# EAGLE board cpu (EAGLE 4.15), part 1 of 3
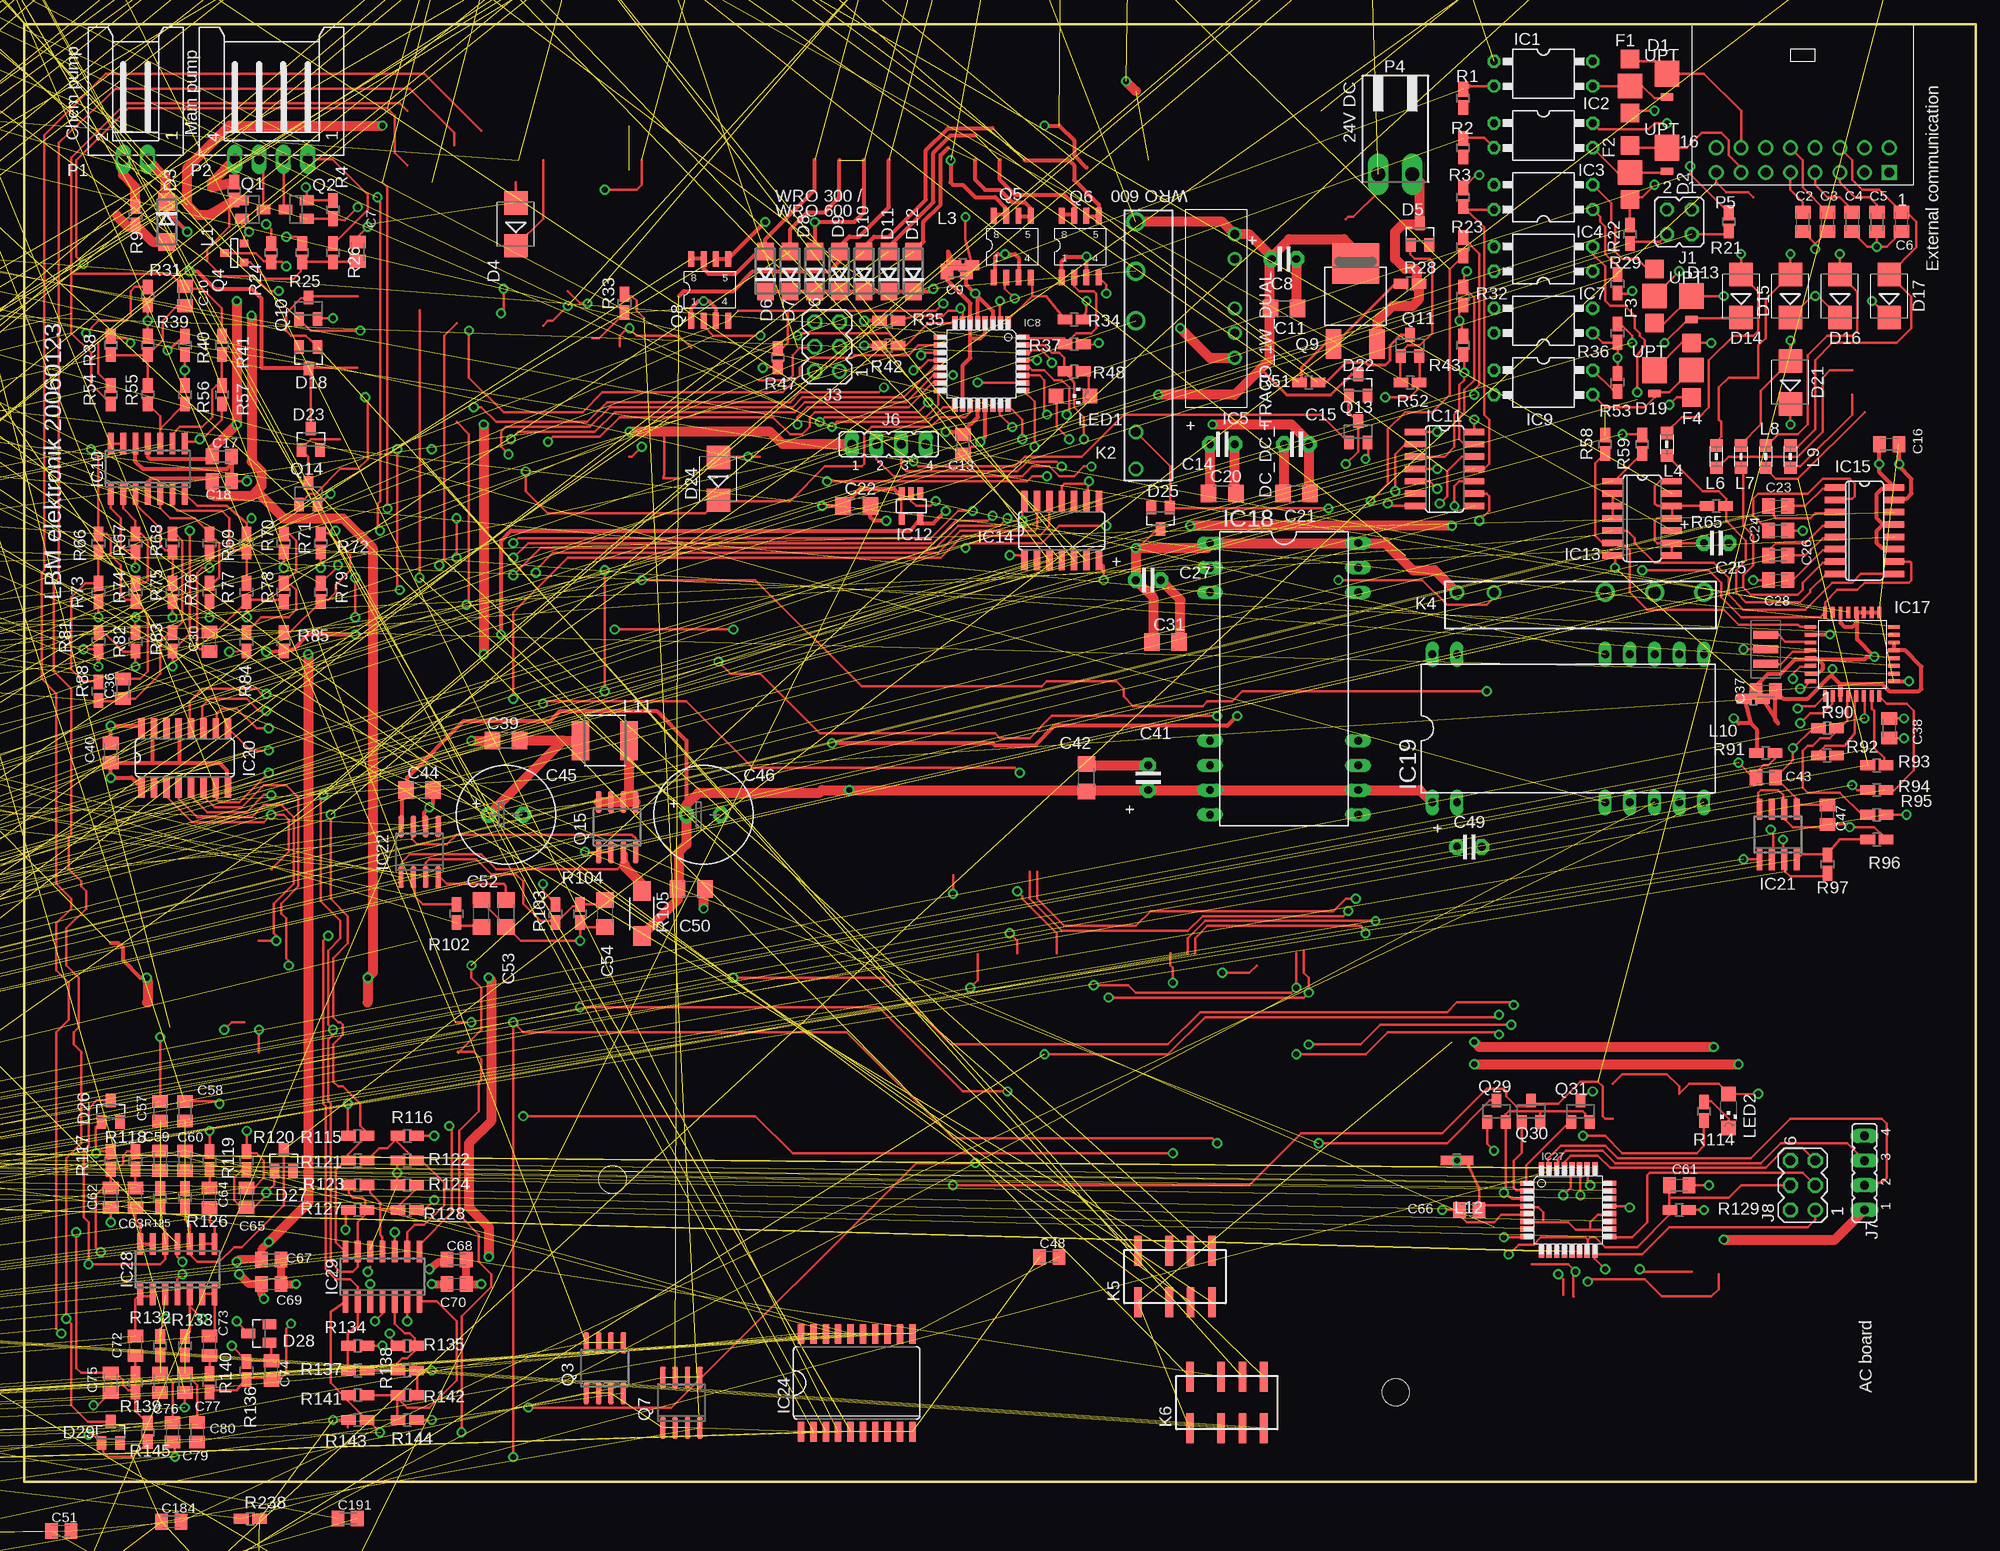
[diagram p20: board, top side]
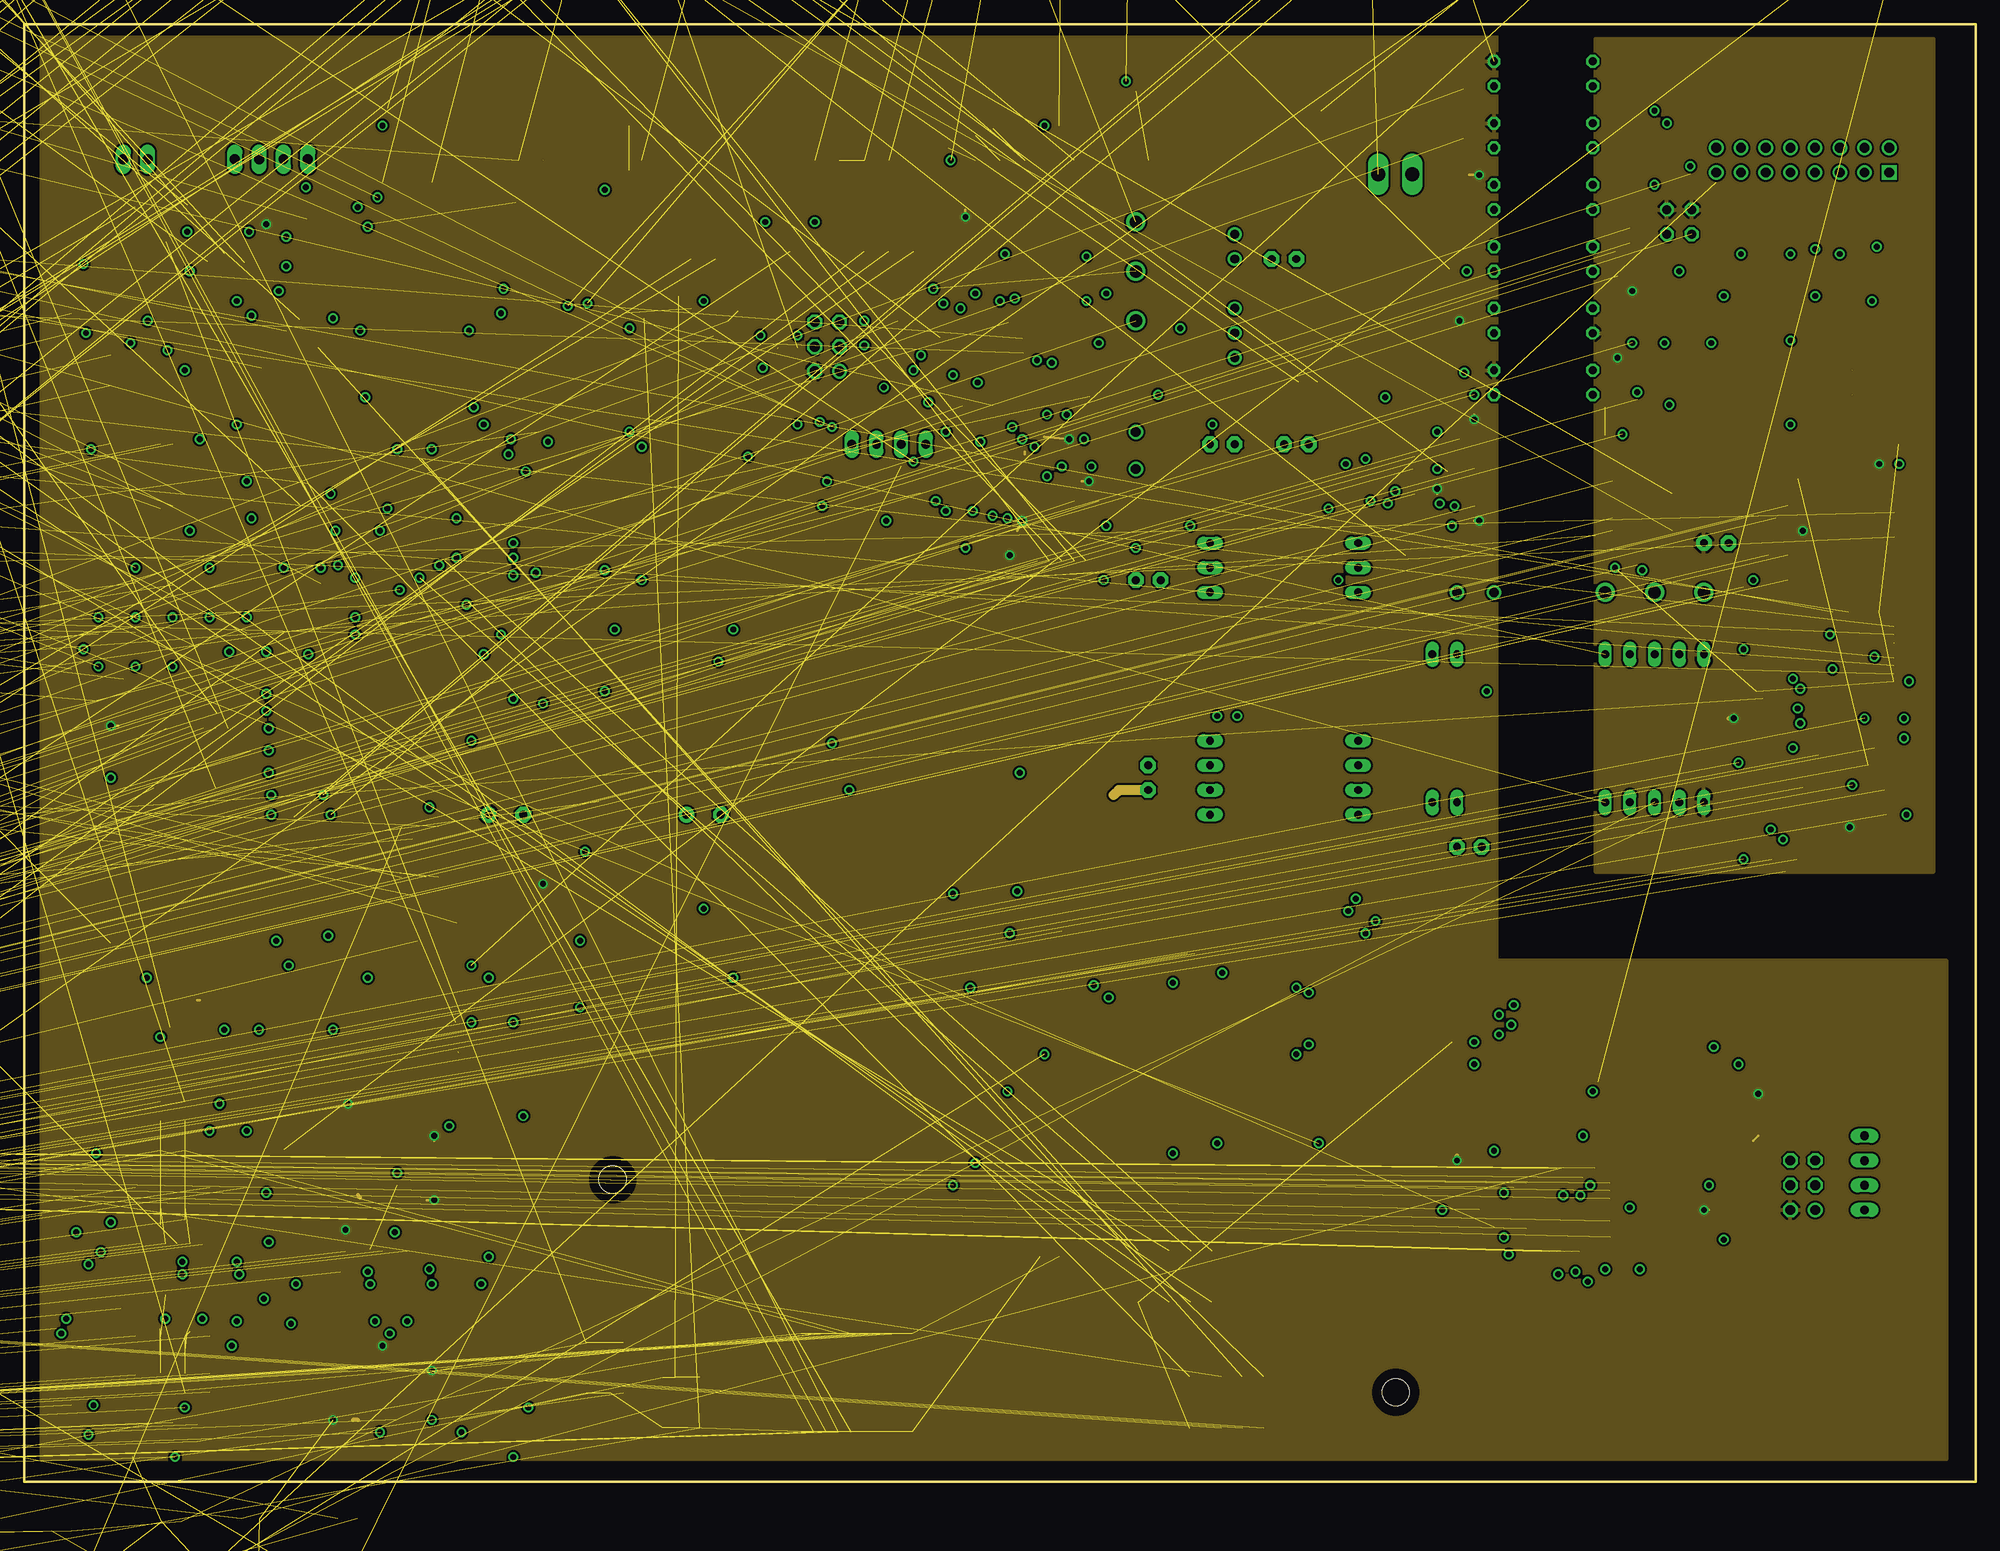
[diagram p21: board, inner layer Route2]
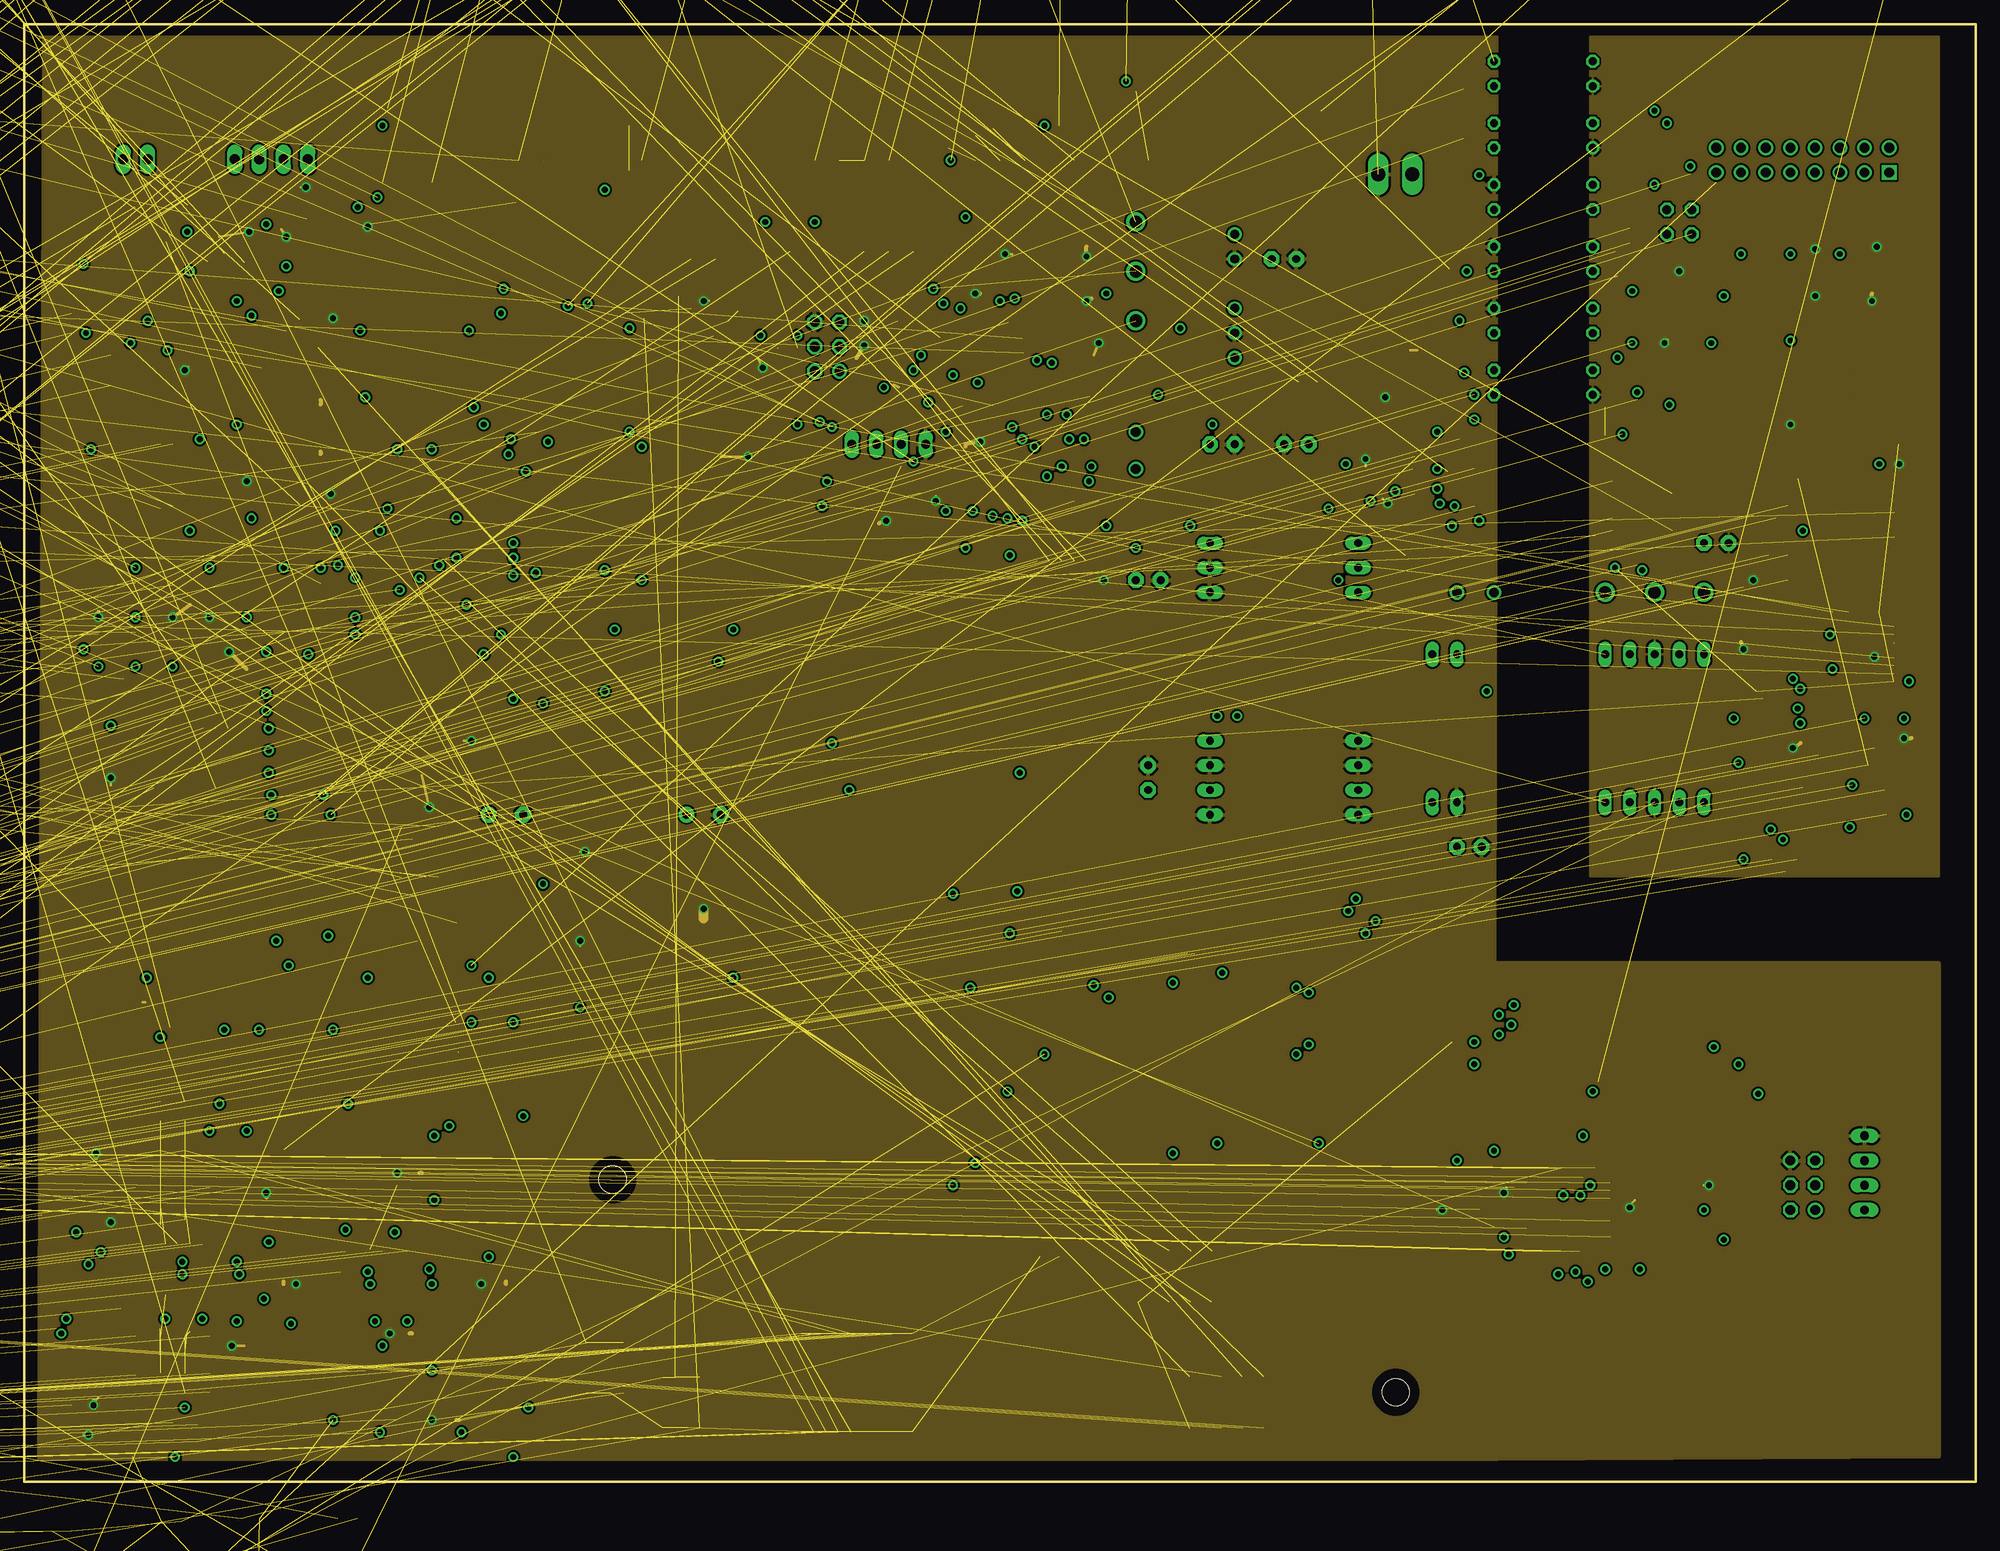
[diagram p22: board, inner layer Route15]
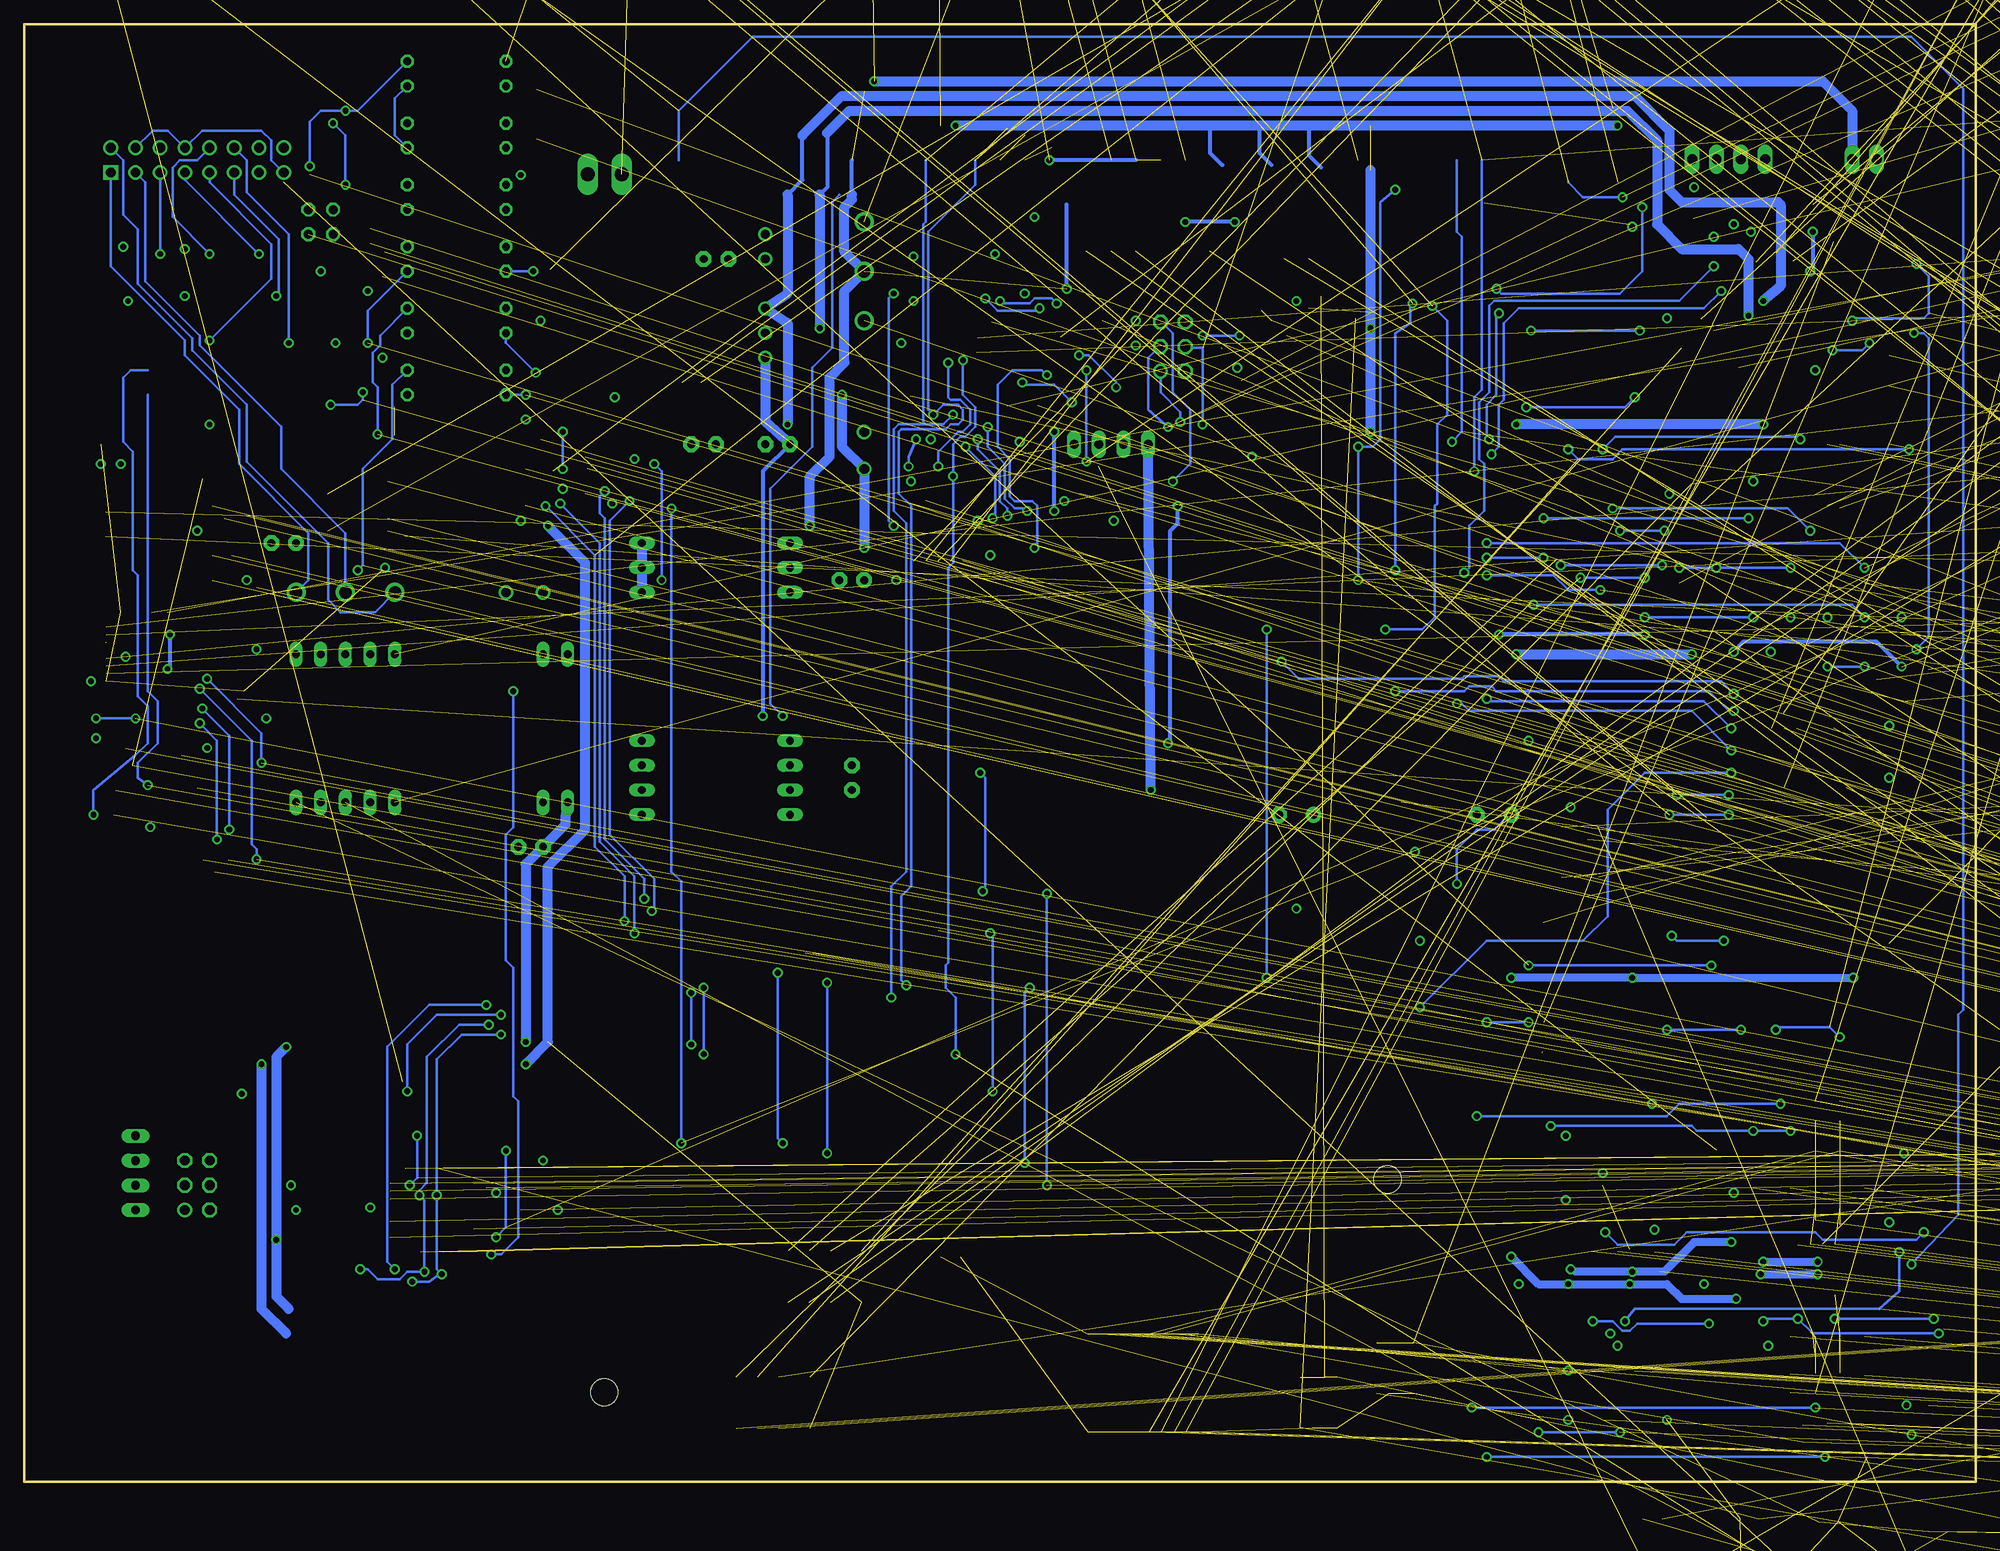
[diagram p23: board, bottom side, seen from below]

Size 200.66 x 149.86 mm. Coordinates in mm from the lower left corner, seen from the top.
Outline: 0,0 200.66,0 200.66,149.86 0,149.86 0,0
Copper layers (1*2+15*16): Top 0.035mm / dielectric 1.5mm / Route2 0.035mm / dielectric 0.15mm / Route15 0.035mm / dielectric 0.2mm / Bottom 0.035mm
Design rules "default": minimum track width 10mil, minimum drill 23mil, track to track 8mil, track to pad 8mil, pad to pad 8mil, via to via 8mil, smd to smd 8mil, copper to edge 40mil, drill to drill 8mil, minimum pad ring 10mil, minimum via ring 8mil, stop-mask expansion 4mil, vias tented up to drill 0mil, thermal gap 10mil
Holes 2.8 mm at 141.03,9.19 60.49,31.06
tKeepout: area 51.8,1.3 to 72.1,55.9; area 76.2,1.3 to 143.5,48.3; area 165.1,41.9 to 188,64.8

## Footprints (pad centres in the part's own frame; a part is rotated, then mirrored left to right if it is on the bottom)
C0805K = smd 1.3 x 1.6: 1 -1,0; 2 1,0
CAP2.5 = drill 0.813 pad 1.6 octagon: 1 -2.54,0; 2 0,0
C1206 = smd 1.6 x 1.8: 1 -1.4,0; 2 1.4,0
E3,5-10 = drill 0.813 pad 1.6 round: + -1.778,0 | drill 0.813 pad 1.6 octagon: - 1.778,0
UPT = smd 1.27 x 0.762: P$1 0,2.413 | smd 2.54 x 2.667: P$2 0,0
DO214AC = smd 1.8 x 1.7: A 2.05,0; C -2.05,0
SMB = smd 2.4 x 2.4: A 2.2,0; C -2.2,0
SOT23 = smd 1 x 1.4: 1 -0.95,-1.1; 2 0.95,-1.1; 3 0,1.1
T_FILTER = smd 2.54 x 2.54: P$1 0,0 | smd 1.905 x 1.905: P$2 -2.794,0; P$3 2.794,0
LVC2G74 = smd 0.3 x 0.7: 1 0.3,-2.5; 2 0.8,-2.5; 3 1.3,-2.5; 4 1.8,-2.5; 5 1.8,0.2; 6 1.3,0.2; 7 0.8,0.2; 8 0.3,0.2
CR2032V = drill 1.321 pad 3.15 octagon: + -2.54,-5.08; +@1 -2.54,5.08; - 2.286,0
DIL04B = drill 0.813 octagon: 1 -1.27,-5.08; 2 1.27,-5.08; 3 1.27,5.08; 4 -1.27,5.08
DC_DC_TRACO_1W_DUAL = drill 0.9 round: 1 -5.08,3.81; 2 -2.54,3.81; 3 2.54,3.81; 4 5.08,3.81; 5 7.62,3.81
SO14 = smd 0.66 x 2.032: 1 -3.81,-3.073; 2 -2.54,-3.073; 3 -1.27,-3.073; 4 0,-3.073; 5 1.27,-3.073; 6 2.54,-3.073; 7 3.81,-3.073; 8 3.81,3.073; 9 2.54,3.073; 10 1.27,3.073; 11 0,3.073; 12 -1.27,3.073; 13 -2.54,3.073; 14 -3.81,3.073
TQFP-32 = smd 1.27 x 0.559: 1 -4.293,2.743; 2 -4.293,1.956; 3 -4.293,1.168; 4 -4.293,0.381; 5 -4.293,-0.381; 6 -4.293,-1.168; 7 -4.293,-1.956; 8 -4.293,-2.743; 17 4.293,-2.743; 18 4.293,-1.956; 19 4.293,-1.168; 20 4.293,-0.381; 21 4.293,0.381; 22 4.293,1.168; 23 4.293,1.956; 24 4.293,2.743 | smd 0.559 x 1.27: 9 -2.743,-4.293; 10 -1.956,-4.293; 11 -1.168,-4.293; 12 -0.381,-4.293; 13 0.381,-4.293; 14 1.168,-4.293; 15 1.956,-4.293; 16 2.743,-4.293; 25 2.743,4.293; 26 1.956,4.293; 27 1.168,4.293; 28 0.381,4.293; 29 -0.381,4.293; 30 -1.168,4.293; 31 -1.956,4.293; 32 -2.743,4.293
SO14' = smd 0.6 x 2.2: 1 -3.81,-2.6; 2 -2.54,-2.6; 3 -1.27,-2.6; 4 0,-2.6; 5 1.27,-2.6; 6 2.54,-2.6; 7 3.81,-2.6; 8 3.81,2.6; 9 2.54,2.6; 10 1.27,2.6; 11 0,2.6; 12 -1.27,2.6; 13 -2.54,2.6; 14 -3.81,2.6
SOT23-5 = smd 0.6 x 1.2: 1 -0.95,-1.306; 2 0,-1.306; 3 0.95,-1.306; 4 0.95,1.306; 5 -0.95,1.306
SO16 = smd 0.66 x 2.032: 1 -4.445,-3.073; 2 -3.175,-3.073; 3 -1.905,-3.073; 4 -0.635,-3.073; 5 0.635,-3.073; 6 1.905,-3.073; 7 3.175,-3.073; 8 4.445,-3.073; 9 4.445,3.073; 10 3.175,3.073; 11 1.905,3.073; 12 0.635,3.073; 13 -0.635,3.073; 14 -1.905,3.073; 15 -3.175,3.073; 16 -4.445,3.073
LQFP32 = smd 0.4 x 1.2: 1 -2.8,-4.3; 2 -2,-4.3; 3 -1.2,-4.3; 4 -0.4,-4.3; 5 0.4,-4.3; 6 1.2,-4.3; 7 2,-4.3; 8 2.8,-4.3; 17 2.8,4.3; 18 2,4.3; 19 1.2,4.3; 20 0.4,4.3; 21 -0.4,4.3; 22 -1.2,4.3; 23 -2,4.3; 24 -2.8,4.3 | smd 1.2 x 0.4: 9 4.3,-2.8; 10 4.3,-2; 11 4.3,-1.2; 12 4.3,-0.4; 13 4.3,0.4; 14 4.3,1.2; 15 4.3,2; 16 4.3,2.8; 25 -4.3,2.8; 26 -4.3,2; 27 -4.3,1.2; 28 -4.3,0.4; 29 -4.3,-0.4; 30 -4.3,-1.2; 31 -4.3,-2; 32 -4.3,-2.8
DIL_TRACO_DCDC = drill 0.813 long: 1 -13.97,-7.62; 2 -11.43,-7.62; 3 -8.89,-7.62; 9 6.35,-7.62; 10 8.89,-7.62; 11 11.43,-7.62; 12 13.97,-7.62; 13 13.97,7.62; 14 11.43,7.62; 15 8.89,7.62; 16 6.35,7.62; 22 -8.89,7.62; 23 -11.43,7.62; 24 -13.97,7.62
DIL_NMSC_DCDC = drill 0.813 long: 1 -13.97,-7.62; 2 -11.43,-7.62; 8 3.81,-7.62; 9 6.35,-7.62; 10 8.89,-7.62; 11 11.43,-7.62; 12 13.97,-7.62; 13 13.97,7.62; 14 11.43,7.62; 15 8.89,7.62; 16 6.35,7.62; 17 3.81,7.62; 23 -11.43,7.62; 24 -13.97,7.62
SO-08 = smd 0.6 x 2.2: 1 -1.905,-2.6; 2 -0.635,-2.6; 3 0.635,-2.6; 4 1.905,-2.6; 5 1.905,2.6; 6 0.635,2.6; 7 -0.635,2.6; 8 -1.905,2.6
SO8 = smd 0.6 x 2.2: 1 -1.905,-2.6; 2 -0.635,-2.6; 3 0.635,-2.6; 4 1.905,-2.6; 5 1.905,2.6; 6 0.635,2.6; 7 -0.635,2.6; 8 -1.905,2.6
SO20W = smd 0.66 x 2.032: 1 -5.715,-5.029; 2 -4.445,-5.029; 3 -3.175,-5.029; 4 -1.905,-5.029; 5 -0.635,-5.029; 6 0.635,-5.029; 7 1.905,-5.029; 8 3.175,-5.029; 9 4.445,-5.029; 10 5.715,-5.029; 11 5.715,5.029; 12 4.445,5.029; 13 3.175,5.029; 14 1.905,5.029; 15 0.635,5.029; 16 -0.635,5.029; 17 -1.905,5.029; 18 -3.175,5.029; 19 -4.445,5.029; 20 -5.715,5.029
TSOP54 = smd 0.4 x 1.5: 1 -10.4,-5.08; 2 -9.6,-5.08; 3 -8.8,-5.08; 4 -8,-5.08; 5 -7.2,-5.08; 6 -6.4,-5.08; 7 -5.6,-5.08; 8 -4.8,-5.08; 9 -4,-5.08; 10 -3.2,-5.08; 11 -2.4,-5.08; 12 -1.6,-5.08; 13 -0.8,-5.08; 14 0,-5.08; 15 0.8,-5.08; 16 1.6,-5.08; 17 2.4,-5.08; 18 3.2,-5.08; 19 4,-5.08; 20 4.8,-5.08; 21 5.6,-5.08; 22 6.4,-5.08; 23 7.2,-5.08; 24 8,-5.08; 25 8.8,-5.08; 26 9.6,-5.08; 27 10.4,-5.08; 28 10.4,5.08; 29 9.6,5.08; 30 8.8,5.08; 31 8,5.08; 32 7.2,5.08; 33 6.4,5.08; 34 5.6,5.08; 35 4.8,5.08; 36 4,5.08; 37 3.2,5.08; 38 2.4,5.08; 39 1.6,5.08; 40 0.8,5.08; 41 0,5.08; 42 -0.8,5.08; 43 -1.6,5.08; 44 -2.4,5.08; 45 -3.2,5.08; 46 -4,5.08; 47 -4.8,5.08; 48 -5.6,5.08; 49 -6.4,5.08; 50 -7.2,5.08; 51 -8,5.08; 52 -8.8,5.08; 53 -9.6,5.08; 54 -10.4,5.08
ADM811 = smd 1.14 x 0.89: 1 -1.3,1.38 | smd 1.14 x 0.5: 2 -1.3,-0.53; 3 1.34,-0.53; 4 1.35,1.39
JP2Q = drill 0.914 octagon: 1 -1.27,-1.27; 2 -1.27,1.27; 3 1.27,-1.27; 4 1.27,1.27
MA03-2 = drill 1.016 round: 1 -2.54,-1.27 | drill 1.016 octagon: 2 -2.54,1.27; 3 0,-1.27; 4 0,1.27; 5 2.54,-1.27; 6 2.54,1.27
JP4 = drill 0.914 long: 1 -3.81,0; 2 -1.27,0; 3 1.27,0; 4 3.81,0
JTAG_HEADER = smd 2.413 x 0.457: 1 -0.127,-0.635; 2 3.556,-0.635; 3 -0.127,-1.905; 4 3.556,-1.905; 5 -0.127,-3.175; 6 3.556,-3.175; 7 -0.127,-4.445; 8 3.556,-4.445; 9 -0.127,-5.715; 10 3.556,-5.715; 11 -0.127,-6.985; 12 3.556,-6.985; 13 -0.127,-8.255; 14 3.556,-8.255; 15 -0.127,-9.525; 16 3.556,-9.525; 17 -0.127,-10.795; 18 3.556,-10.795; 19 -0.127,-12.065; 20 3.556,-12.065
SNR-V = drill 1.3 round: 11 7.62,1.27; 12 2.54,1.27; 14 12.7,1.27 | drill 1 round: A1 -12.7,1.27; A2 -8.89,1.27
GN-A = smd 0.8 x 3.1: 1 -3.835,-2.65; 2 -0.635,-2.65; 3 1.565,-2.65; 4 3.765,-2.65; 5 3.765,2.65; 6 1.565,2.65; 7 -0.635,2.65; 8 -3.835,2.65
L-0603 = smd 1.5 x 1: 1 -0.94,0; 2 0.94,0
IND_BLM = smd 1.27 x 1.27: P$1 -1.143,0; P$2 1.143,0
L5650M = smd 1.8 x 4: 1 -2.5,0; 2 2.5,0
CHIPLED_1206 = smd 1.5 x 1.5: A 0,-1.75; C 0,1.75
L02P = drill 1.016 long: 1 1.25,-6.25; 2 -1.25,-6.25
L04P = drill 1.016 long: 1 3.75,-6.25; 2 1.25,-6.25; 3 -1.25,-6.25; 4 -3.75,-6.25
MODU30 = drill 1 square: 1 22.86,-5.08 | drill 1 round: 2 20.32,-5.08; 3 17.78,-5.08; 4 15.24,-5.08; 5 12.7,-5.08; 6 10.16,-5.08; 7 7.62,-5.08; 8 5.08,-5.08; 9 2.54,-5.08; 10 0,-5.08; 11 -2.54,-5.08; 12 -5.08,-5.08; 13 -7.62,-5.08; 14 -10.16,-5.08; 15 -12.7,-5.08; 16 22.86,-2.54; 17 20.32,-2.54; 18 17.78,-2.54; 19 15.24,-2.54; 20 12.7,-2.54; 21 10.16,-2.54; 22 7.62,-2.54; 23 5.08,-2.54; 24 2.54,-2.54; 25 0,-2.54; 26 -2.54,-2.54; 27 -5.08,-2.54; 28 -7.62,-2.54; 29 -10.16,-2.54; 30 -12.7,-2.54
90-2 = drill 1.422 long: 1 -1.75,5.25; 2 1.75,5.25
MODU16 = drill 1 square: P$1 13.97,-5.08 | drill 1 round: P$2 11.43,-5.08; P$3 8.89,-5.08; P$4 6.35,-5.08; P$5 3.81,-5.08; P$6 1.27,-5.08; P$7 -1.27,-5.08; P$8 -3.81,-5.08; P$13 13.97,-2.54; P$14 11.43,-2.54; P$15 8.89,-2.54; P$16 6.35,-2.54; P$17 3.81,-2.54; P$18 1.27,-2.54; P$19 -1.27,-2.54; P$20 -3.81,-2.54
MODU44 = drill 1 square: P$1 0,0 | drill 1 round: P$2 -2.54,0; P$3 -5.08,0; P$4 -7.62,0; P$5 -10.16,0; P$6 -12.7,0; P$7 -15.24,0; P$8 -17.78,0; P$9 -20.32,0; P$10 -22.86,0; P$11 -25.4,0; P$12 -27.94,0; P$13 -30.48,0; P$14 -33.02,0; P$15 -35.56,0; P$16 -38.1,0; P$17 -40.64,0; P$18 -43.18,0; P$19 -45.72,0; P$20 -48.26,0; P$21 -50.8,0; P$22 -53.34,0; P$23 0,2.54; P$24 -2.54,2.54; P$25 -5.08,2.54; P$26 -7.62,2.54; P$27 -10.16,2.54; P$28 -12.7,2.54; P$29 -15.24,2.54; P$30 -17.78,2.54; P$31 -20.32,2.54; P$32 -22.86,2.54; P$33 -25.4,2.54; P$34 -27.94,2.54; P$35 -30.48,2.54; P$36 -33.02,2.54; P$37 -35.56,2.54; P$38 -38.1,2.54; P$39 -40.64,2.54; P$40 -43.18,2.54; P$41 -45.72,2.54; P$42 -48.26,2.54; P$43 -50.8,2.54; P$44 -53.34,2.54
RJ_45 = drill 0.889 round: 1 0.762,-1.524; 2 2.032,1.016; 3 3.302,-1.524; 4 4.572,1.016; 5 5.842,-1.524; 6 7.112,1.016; 7 8.382,-1.524; 8 9.652,1.016; 9 -0.508,1.016; 10 10.922,-1.524 | drill 1.016 round: 11 -1.778,-11.938; 12 0.762,-11.938; 13 9.652,-11.938; 14 12.192,-11.938 | drill 1.549 round: 15 -1.524,-4.318; 16 11.938,-4.318 | hole 3.251: 10.922,-7.874; -0.508,-7.874
SOT-23 = smd 0.787 x 0.889: 1 0.025,-1.016; 2 -0.94,1.016; 3 0.991,1.016
SO8-2 = smd 0.61 x 1.626: 1 -2.54,-2.54; 2 -1.27,-2.54; 3 0,-2.54; 4 1.27,-2.54; 5 1.27,3.81; 6 0,3.81; 7 -1.27,3.81; 8 -2.54,3.81
DPAK = smd 1.6 x 2.997: 1 -2.261,-4.928; 3 2.21,-4.928 | smd 4.826 x 4.191: 4 0,3.353
SOT54A = drill 0.813 octagon: B 0,1.905; C -1.27,0; E 1.27,0
R0805W = smd 1.5 x 1: 1 -0.94,0; 2 0.94,0
R2010W = smd 2 x 1.8: 1 -2.311,0; 2 2.311,0
NS9360 = smd 0.762 x 0.762: A1 0,0; A2 0,-1.27; A3 0,-2.54; A4 0,-3.81; A5 0,-5.08; A6 0,-6.35; A7 0,-7.62; A8 0,-8.89; A9 0,-10.16; A10 0,-11.43; A11 0,-12.7; A12 0,-13.97; A13 0,-15.24; A14 0,-16.51; A15 0,-17.78; A16 0,-19.05; A17 0,-20.32; A18 0,-21.59; A19 0,-22.86; A20 0,-24.13; B1 -1.27,0; B2 -1.27,-1.27; B3 -1.27,-2.54; B4 -1.27,-3.81; B5 -1.27,-5.08; B6 -1.27,-6.35; B7 -1.27,-7.62; B8 -1.27,-8.89; B9 -1.27,-10.16; B10 -1.27,-11.43; B11 -1.27,-12.7; B12 -1.27,-13.97; B13 -1.27,-15.24; B14 -1.27,-16.51; B15 -1.27,-17.78; B16 -1.27,-19.05; B17 -1.27,-20.32; B18 -1.27,-21.59; B19 -1.27,-22.86; B20 -1.27,-24.13; C1 -2.54,0; C2 -2.54,-1.27; C3 -2.54,-2.54; C4 -2.54,-3.81; C5 -2.54,-5.08; C6 -2.54,-6.35; C7 -2.54,-7.62; C8 -2.54,-8.89; C9 -2.54,-10.16; C10 -2.54,-11.43; C11 -2.54,-12.7; C12 -2.54,-13.97; C13 -2.54,-15.24; C14 -2.54,-16.51; C15 -2.54,-17.78; C16 -2.54,-19.05; C17 -2.54,-20.32; C18 -2.54,-21.59; C19 -2.54,-22.86; C20 -2.54,-24.13; D1 -3.81,0; D2 -3.81,-1.27; D3 -3.81,-2.54; D4 -3.81,-3.81; D5 -3.81,-5.08; D6 -3.81,-6.35; D7 -3.81,-7.62; D8 -3.81,-8.89; D9 -3.81,-10.16; D10 -3.81,-11.43; D11 -3.81,-12.7; D12 -3.81,-13.97; D13 -3.81,-15.24; D14 -3.81,-16.51; D15 -3.81,-17.78; D16 -3.81,-19.05; D17 -3.81,-20.32; D18 -3.81,-21.59; D19 -3.81,-22.86; D20 -3.81,-24.13; E1 -5.08,0; E2 -5.08,-1.27; E3 -5.08,-2.54; E4 -5.08,-3.81; E17 -5.08,-20.32; E18 -5.08,-21.59; E19 -5.08,-22.86; E20 -5.08,-24.13; F1 -6.35,0; F2 -6.35,-1.27; F3 -6.35,-2.54; F4 -6.35,-3.81; F17 -6.35,-20.32; F18 -6.35,-21.59; F19 -6.35,-22.86; F20 -6.35,-24.13; G1 -7.62,0; G2 -7.62,-1.27; G3 -7.62,-2.54; G4 -7.62,-3.81; G17 -7.62,-20.32; G18 -7.62,-21.59; G19 -7.62,-22.86; G20 -7.62,-24.13; H1 -8.89,0; H2 -8.89,-1.27; H3 -8.89,-2.54; H4 -8.89,-3.81; H17 -8.89,-20.32; H18 -8.89,-21.59; H19 -8.89,-22.86; H20 -8.89,-24.13; J1 -10.16,0; J2 -10.16,-1.27; J3 -10.16,-2.54; J4 -10.16,-3.81; J9 -10.16,-10.16; J10 -10.16,-11.43; J11 -10.16,-12.7; J12 -10.16,-13.97; J17 -10.16,-20.32; J18 -10.16,-21.59; J19 -10.16,-22.86; J20 -10.16,-24.13; K1 -11.43,0; K2 -11.43,-1.27; K3 -11.43,-2.54; K4 -11.43,-3.81; K9 -11.43,-10.16; K10 -11.43,-11.43; K11 -11.43,-12.7; K12 -11.43,-13.97; K17 -11.43,-20.32; K18 -11.43,-21.59; K19 -11.43,-22.86; K20 -11.43,-24.13; L1 -12.7,0; L2 -12.7,-1.27; L3 -12.7,-2.54; L4 -12.7,-3.81; L9 -12.7,-10.16; L10 -12.7,-11.43; L11 -12.7,-12.7; L12 -12.7,-13.97; L17 -12.7,-20.32; L18 -12.7,-21.59; L19 -12.7,-22.86; L20 -12.7,-24.13; M1 -13.97,0; M2 -13.97,-1.27; M3 -13.97,-2.54; M4 -13.97,-3.81; M9 -13.97,-10.16; M10 -13.97,-11.43; M11 -13.97,-12.7; M12 -13.97,-13.97; M17 -13.97,-20.32; M18 -13.97,-21.59; M19 -13.97,-22.86; M20 -13.97,-24.13; N1 -15.24,0; N2 -15.24,-1.27; N3 -15.24,-2.54; N4 -15.24,-3.81; N17 -15.24,-20.32; N18 -15.24,-21.59; N19 -15.24,-22.86; N20 -15.24,-24.13; P1 -16.51,0; P2 -16.51,-1.27; P3 -16.51,-2.54; P4 -16.51,-3.81; P17 -16.51,-20.32; P18 -16.51,-21.59; P19 -16.51,-22.86; P20 -16.51,-24.13; R1 -17.78,0; R2 -17.78,-1.27; R3 -17.78,-2.54; R4 -17.78,-3.81; R17 -17.78,-20.32; R18 -17.78,-21.59; R19 -17.78,-22.86; R20 -17.78,-24.13; T1 -19.05,0; T2 -19.05,-1.27; T3 -19.05,-2.54; T4 -19.05,-3.81; T17 -19.05,-20.32; T18 -19.05,-21.59; T19 -19.05,-22.86; T20 -19.05,-24.13; U1 -20.32,0; U2 -20.32,-1.27; U3 -20.32,-2.54; U4 -20.32,-3.81; U5 -20.32,-5.08; U6 -20.32,-6.35; U7 -20.32,-7.62; U8 -20.32,-8.89; U9 -20.32,-10.16; U10 -20.32,-11.43; U11 -20.32,-12.7; U12 -20.32,-13.97; U13 -20.32,-15.24; U14 -20.32,-16.51; U15 -20.32,-17.78; U16 -20.32,-19.05; U17 -20.32,-20.32; U18 -20.32,-21.59; U19 -20.32,-22.86; U20 -20.32,-24.13; V1 -21.59,0; V2 -21.59,-1.27; V3 -21.59,-2.54; V4 -21.59,-3.81; V5 -21.59,-5.08; V6 -21.59,-6.35; V7 -21.59,-7.62; V8 -21.59,-8.89; V9 -21.59,-10.16; V10 -21.59,-11.43; V11 -21.59,-12.7; V12 -21.59,-13.97; V13 -21.59,-15.24; V14 -21.59,-16.51; V15 -21.59,-17.78; V16 -21.59,-19.05; V17 -21.59,-20.32; V18 -21.59,-21.59; V19 -21.59,-22.86; V20 -21.59,-24.13; W1 -22.86,0; W2 -22.86,-1.27; W3 -22.86,-2.54; W4 -22.86,-3.81; W5 -22.86,-5.08; W6 -22.86,-6.35; W7 -22.86,-7.62; W8 -22.86,-8.89; W9 -22.86,-10.16; W10 -22.86,-11.43; W11 -22.86,-12.7; W12 -22.86,-13.97; W13 -22.86,-15.24; W14 -22.86,-16.51; W15 -22.86,-17.78; W16 -22.86,-19.05; W17 -22.86,-20.32; W18 -22.86,-21.59; W19 -22.86,-22.86; W20 -22.86,-24.13; Y1 -24.13,0; Y2 -24.13,-1.27; Y3 -24.13,-2.54; Y4 -24.13,-3.81; Y5 -24.13,-5.08; Y6 -24.13,-6.35; Y7 -24.13,-7.62; Y8 -24.13,-8.89; Y9 -24.13,-10.16; Y10 -24.13,-11.43; Y11 -24.13,-12.7; Y12 -24.13,-13.97; Y13 -24.13,-15.24; Y14 -24.13,-16.51; Y15 -24.13,-17.78; Y16 -24.13,-19.05; Y17 -24.13,-20.32; Y18 -24.13,-21.59; Y19 -24.13,-22.86; Y20 -24.13,-24.13
TESTPAD = drill 1.321 pad 2.159 octagon: 1 0,0
TSOP48 = smd 0.3 x 1.6: 1 -5.75,-10.87; 2 -5.25,-10.87; 3 -4.75,-10.87; 4 -4.25,-10.87; 5 -3.75,-10.87; 6 -3.25,-10.87; 7 -2.75,-10.87; 8 -2.25,-10.87; 9 -1.75,-10.87; 10 -1.25,-10.87; 11 -0.75,-10.87; 12 -0.25,-10.87; 13 0.25,-10.87; 14 0.75,-10.87; 15 1.25,-10.87; 16 1.75,-10.87; 17 2.25,-10.87; 18 2.75,-10.87; 19 3.25,-10.87; 20 3.75,-10.87; 21 4.25,-10.87; 22 4.75,-10.87; 23 5.25,-10.87; 24 5.75,-10.87; 25 5.75,8.33; 26 5.25,8.33; 27 4.75,8.33; 28 4.25,8.33; 29 3.75,8.33; 30 3.25,8.33; 31 2.75,8.33; 32 2.25,8.33; 33 1.75,8.33; 34 1.25,8.33; 35 0.75,8.33; 36 0.25,8.33; 37 -0.25,8.33; 38 -0.75,8.33; 39 -1.25,8.33; 40 -1.75,8.33; 41 -2.25,8.33; 42 -2.75,8.33; 43 -3.25,8.33; 44 -3.75,8.33; 45 -4.25,8.33; 46 -4.75,8.33; 47 -5.25,8.33; 48 -5.75,8.33
MSOP8 = smd 0.4 x 1.1: 1 -0.975,-2.25; 2 -0.325,-2.25; 3 0.325,-2.25; 4 0.975,-2.25; 5 0.975,2.25; 6 0.325,2.25; 7 -0.325,2.25; 8 -0.975,2.25
ISC1893BF = smd 1.54 x 0.34: 1 -0.83,-0.68; 2 -0.83,-1.32; 3 -0.83,-1.97; 4 -0.83,-2.61; 5 -0.83,-3.24; 6 -0.83,-3.88; 7 -0.83,-4.53; 8 -0.83,-5.17; 9 -0.83,-5.83; 10 -0.83,-6.47; 11 -0.83,-7.12; 12 -0.83,-7.76; 13 -0.83,-8.39; 14 -0.83,-9.03; 15 -0.83,-9.68; 16 -0.83,-10.32; 17 -0.83,-10.96; 18 -0.83,-11.6; 19 -0.83,-12.25; 20 -0.83,-12.89; 21 -0.83,-13.52; 22 -0.83,-14.16; 23 -0.83,-14.81; 24 -0.83,-15.45; 25 8.46,-15.46; 26 8.46,-14.82; 27 8.46,-14.17; 28 8.46,-13.53; 29 8.46,-12.9; 30 8.46,-12.26; 31 8.46,-11.61; 32 8.46,-10.97; 33 8.46,-10.33; 34 8.46,-9.69; 35 8.46,-9.04; 36 8.46,-8.4; 37 8.46,-7.77; 38 8.46,-7.13; 39 8.46,-6.48; 40 8.46,-5.84; 41 8.46,-5.18; 42 8.46,-4.54; 43 8.46,-3.89; 44 8.46,-3.25; 45 8.46,-2.62; 46 8.46,-1.98; 47 8.46,-1.33; 48 8.46,-0.69
MURATA_RESONATOR = smd 0.8 x 2.6: 1 -1.5,0; 2 0,0; 3 1.5,0
MM20SS = smd 1.27 x 1.88: 1 -2.794,-1.524; 2 2.794,-1.524; 3 2.794,1.524; 4 -2.794,1.524
HC49_4H_SMX = smd 5.5 x 2: 1 2.5,-1; 2 12,-1
EMI_FILTER_1206 = smd 0.4 x 1.1: 1 0,-0.82; 2 3.4,-0.86 | smd 0.4 x 0.3: 3 0.46,-1.68; 4 1.28,-1.68; 5 2.06,-1.68; 6 2.88,-1.68; 7 0.484,-0.02; 8 1.26,-0.02; 9 2.076,-0.02; 10 2.86,-0.02; P$3 1.26,-0.02; P$21 1.28,-1.68

## Placement (x,y rotation side)
C1  100nF  [C0805K]  477.59,440.28 0 top  (outside the outline)
C2  100n  [C0805K]  182.88,129.54 90 top
C3  100n  [C0805K]  185.42,129.54 90 top
C4  100n  [C0805K]  187.96,129.54 90 top
C5  100n  [C0805K]  190.5,129.54 90 top
C6  100n  [C0805K]  193.04,129.54 90 top
C7  100n  [C0805K]  34.29,126.49 270 top
C8  47u/25V  [CAP2.5]  130.81,125.73 0 top
C9  100n  [C0805K]  95.89,124.46 180 top
C10  100n  [C0805K]  16.51,121.92 90 top
C11  100n  [C1206]  129.54,120.65 0 top
C12  1uF_NM  [C0805K]  -24.07,422.39 0 top  (outside the outline)
C13  100n  [C0805K]  96.52,106.68 90 top
C14  47u/25V  [CAP2.5]  124.46,106.68 0 top
C15  47u/25V  [CAP2.5]  132.08,106.68 0 top
C16  100n  [C0805K]  191.77,106.68 180 top
C17  100n  [C0805K]  20.32,105.41 0 top
C18  100n  [C0805K]  20.32,102.87 180 top
C19  1u  [C0805K]  -24.07,422.39 0 top  (outside the outline)
C20  100n  [C1206]  123.19,101.6 0 top
C21  100n  [C1206]  130.81,101.6 0 top
C22  100n  [C1206]  85.6,100.33 0 top
C23  100n  [C0805K]  180.34,100.33 0 top
C24  100n  [C0805K]  180.34,97.79 0 top
C25  47u/25V  [CAP2.5]  175.26,96.52 0 top
C26  100n  [C0805K]  180.34,95.25 180 top
C27  47u/50V  [CAP2.5]  116.84,92.71 0 top
C28  100n  [C0805K]  180.34,92.71 180 top
C29  100n  [C0805K]  -156.87,423.32 0 top  (outside the outline)
C30  100n  [C0805K]  19.05,86.36 90 top
C31  100n  [C1206]  117.35,86.36 0 top
C32  100n  [C0805K]  -147.87,423.32 0 top  (outside the outline)
C33  100n  [C0805K]  -167.55,423.32 0 top  (outside the outline)
C34  100n  [C0805K]  -158.54,423.32 0 top  (outside the outline)
C35  100n  [C0805K]  -149.53,423.32 0 top  (outside the outline)
C36  100n  [C0805K]  10.16,81.53 90 top
C37  100n  [C0805K]  179.07,81.28 0 top
C38  100n  [C0805K]  191.77,77.47 270 top
C39  100n  [C1206]  49.53,76.2 180 top
C40  100n  [C0805K]  8.89,74.93 90 top
C41  47u/25V  [CAP2.5]  115.57,73.66 90 top
C42  100n  [C1206]  109.22,72.39 90 top
C43  100n  [C0805K]  179.07,72.39 0 top
C44  NM  [C1206]  40.64,71.12 0 top
C45  330uF  [E3,5-10]  49.53,68.58 0 top
C46  180uF  [E3,5-10]  69.85,68.58 0 top
C47  100n  [C0805K]  185.42,68.58 270 top
C48  100n  [C0805K]  105.41,23.11 0 top
C49  47u/25V  [CAP2.5]  149.86,65.28 0 top
C50  470p  [C1206]  68.58,60.96 0 top
C51  100n  [C0805K]  3.81,-5.08 0 top  (outside the outline)
C52  220p  [C1206]  46.99,58.42 90 top
C53  470p  [C1206]  49.53,58.42 270 top
C54  100p  [C1206]  59.69,58.42 270 top
C55  100n  [C0805K]  3.81,-12.7 0 top  (outside the outline)
C56  10pF  [C0805K]  -76.29,445.67 0 top  (outside the outline)
C57  1uF_NM  [C0805K]  13.97,38.1 90 top
C58  1uF_NM  [C0805K]  16.51,38.1 90 top
C59  100n  [C0805K]  13.97,33.02 90 top
C60  470n  [C0805K]  16.51,33.02 90 top
C61  1uF_NM  [C0805K]  170.18,30.48 180 top
C62  100p  [C0805K]  8.89,29.21 90 top
C63  1u0  [C0805K]  11.43,29.21 90 top
C64  1u0  [C0805K]  19.05,29.21 90 top
C65  100p  [C0805K]  22.86,29.21 90 top
C66  100n  [C0805K]  148.59,27.94 0 top
C67  100n  [C0805K]  25.4,22.86 0 top
C68  100n  [C0805K]  44.45,22.86 0 top
C69  100n  [C0805K]  25.4,20.32 180 top
C70  100n  [C0805K]  44.45,20.32 180 top
C71  100n  [C0805K]  -152.33,411.82 0 top  (outside the outline)
C72  1u0  [C0805K]  11.43,13.97 270 top
C73  1u0  [C0805K]  19.05,13.97 270 top
C74  100p  [C0805K]  25.4,11.43 270 top
C75  100p  [C0805K]  8.89,10.16 90 top
C76  100n  [C0805K]  13.97,10.16 270 top
C77  1uF_NM  [C0805K]  16.51,10.16 270 top
C78  100n  [C0805K]  -167.55,423.32 0 top  (outside the outline)
C79  1uF_NM  [C0805K]  15.24,5.08 270 top
C80  470n  [C0805K]  17.78,5.08 270 top
C81  10pF  [C0805K]  -67.28,445.68 0 top  (outside the outline)
C82  100nF  [C0805K]  -58.27,445.69 0 top  (outside the outline)
C83  100nF  [C0805K]  -49.26,445.67 0 top  (outside the outline)
C84  100n  [C0805K]  -40.24,445.67 0 top  (outside the outline)
C85  10pF  [C0805K]  -31.23,445.68 0 top  (outside the outline)
C86  100n  [C0805K]  36.37,435.15 0 top  (outside the outline)
C87  10n  [C0805K]  45.38,435.16 0 top  (outside the outline)
C88  100n  [C0805K]  54.39,435.17 0 top  (outside the outline)
C89  10n  [C0805K]  63.41,435.15 0 top  (outside the outline)
C90  10n  [C0805K]  72.42,435.16 0 top  (outside the outline)
C91  10n  [C0805K]  81.43,435.17 0 top  (outside the outline)
C92  1u  [C0805K]  90.44,435.15 0 top  (outside the outline)
C93  1u  [C0805K]  99.45,435.16 0 top  (outside the outline)
C94  1u  [C0805K]  108.46,435.17 0 top  (outside the outline)
C95  1u  [C0805K]  117.47,435.15 0 top  (outside the outline)
C96  10u  [C0805K]  36.37,441.89 0 top  (outside the outline)
C97  10u  [C0805K]  45.38,441.9 0 top  (outside the outline)
C98  10n  [C0805K]  54.39,441.89 0 top  (outside the outline)
C99  1u  [C0805K]  63.41,441.9 0 top  (outside the outline)
C100  10n  [C0805K]  72.42,441.9 0 top  (outside the outline)
C101  100n  [C0805K]  81.43,441.89 0 top  (outside the outline)
C102  10n  [C0805K]  90.44,441.9 0 top  (outside the outline)
C103  100n  [C0805K]  99.45,441.9 0 top  (outside the outline)
C104  10n  [C0805K]  108.46,441.89 0 top  (outside the outline)
C105  10n  [C0805K]  117.47,441.9 0 top  (outside the outline)
C106  10n  [C0805K]  36.37,448.64 0 top  (outside the outline)
C107  100n  [C0805K]  45.38,448.62 0 top  (outside the outline)
C108  10n  [C0805K]  54.39,448.63 0 top  (outside the outline)
C109  10n  [C0805K]  63.41,448.64 0 top  (outside the outline)
C110  1u  [C0805K]  72.42,448.62 0 top  (outside the outline)
C111  10u  [C0805K]  81.43,448.63 0 top  (outside the outline)
C112  10n  [C0805K]  90.44,448.61 0 top  (outside the outline)
C113  10u  [C0805K]  99.45,448.62 0 top  (outside the outline)
C114  100u  [CAP2.5]  115.64,405.13 0 top  (outside the outline)
C115  100n  [C0805K]  108.46,448.63 0 top  (outside the outline)
C116  10u  [C0805K]  117.47,448.62 0 top  (outside the outline)
C117  100n  [C0805K]  36.37,455.36 0 top  (outside the outline)
C118  100n  [C0805K]  45.38,455.37 0 top  (outside the outline)
C119  10n  [C0805K]  54.39,455.35 0 top  (outside the outline)
C120  10n  [C0805K]  94.43,460.66 0 top  (outside the outline)
C121  100n  [C0805K]  87.88,460.94 0 top  (outside the outline)
C122  10n  [C0805K]  96.89,460.94 0 top  (outside the outline)
C123  100n  [C0805K]  105.9,460.94 0 top  (outside the outline)
C124  10n  [C0805K]  114.91,460.94 0 top  (outside the outline)
C125  10n  [C0805K]  36.37,460.94 0 top  (outside the outline)
C126  100n  [C0805K]  45.38,460.94 0 top  (outside the outline)
C127  10n  [C0805K]  54.39,460.94 0 top  (outside the outline)
C128  10n  [C0805K]  180.63,414.3 0 top  (outside the outline)
C129  100n  [C0805K]  189.64,414.31 0 top  (outside the outline)
C130  10n  [C0805K]  198.65,414.32 0 top  (outside the outline)
C131  100n  [C0805K]  207.66,414.3 0 top  (outside the outline)
C132  10n  [C0805K]  216.67,414.31 0 top  (outside the outline)
C133  100n  [C0805K]  225.68,414.32 0 top  (outside the outline)
C134  10n  [C0805K]  234.7,414.3 0 top  (outside the outline)
C135  100n  [C0805K]  243.71,414.31 0 top  (outside the outline)
C136  10n  [C0805K]  252.72,414.32 0 top  (outside the outline)
C137  100n  [C0805K]  261.73,414.3 0 top  (outside the outline)
C138  22p  [C0805K]  270.74,414.32 0 top  (outside the outline)
C139  22p  [C0805K]  180.63,407.58 0 top  (outside the outline)
C140  100n  [C0805K]  189.64,407.57 0 top  (outside the outline)
C141  10n  [C0805K]  198.65,407.58 0 top  (outside the outline)
C142  100n  [C0805K]  22.85,-12.41 0 top  (outside the outline)
C143  100n  [C0805K]  365.03,428.48 0 top  (outside the outline)
C144  100n  [C0805K]  374.04,428.49 0 top  (outside the outline)
C145  100n  [C0805K]  383.05,428.49 0 top  (outside the outline)
C146  22p  [C0805K]  392.07,428.47 0 top  (outside the outline)
C147  22p  [C0805K]  401.08,428.48 0 top  (outside the outline)
C148  100n  [C0805K]  410.09,428.48 0 top  (outside the outline)
C149  100n  [C0805K]  419.1,428.49 0 top  (outside the outline)
C150  100n  [C0805K]  332.03,417.87 0 top  (outside the outline)
C151  100n  [C0805K]  341.05,417.85 0 top  (outside the outline)
C152  100n  [C0805K]  350.06,417.86 0 top  (outside the outline)
C153  12p  [C0805K]  359.07,417.87 0 top  (outside the outline)
C154  12p  [C0805K]  368.08,417.86 0 top  (outside the outline)
C155  100n  [C0805K]  377.09,417.85 0 top  (outside the outline)
C156  100n  [C0805K]  386.1,417.87 0 top  (outside the outline)
C157  1n  [C0805K]  395.11,417.86 0 top  (outside the outline)
C158  10n  [C0805K]  404.12,417.87 0 top  (outside the outline)
C159  10n  [C0805K]  413.13,417.86 0 top  (outside the outline)
C160  10n  [C0805K]  422.14,417.86 0 top  (outside the outline)
C161  10n  [C0805K]  332.03,411.11 0 top  (outside the outline)
C162  1u  [C0805K]  486.6,440.26 0 top  (outside the outline)
C163  1u  [C0805K]  495.61,440.27 0 top  (outside the outline)
C164  5n6  [C0805K]  504.62,440.29 0 top  (outside the outline)
C165  5n6  [C0805K]  513.63,440.27 0 top  (outside the outline)
C166  10u  [C0805K]  522.64,440.28 0 top  (outside the outline)
C167  1u  [C0805K]  531.65,440.26 0 top  (outside the outline)
C168  1u  [C0805K]  540.67,440.27 0 top  (outside the outline)
C169  5n6  [C0805K]  549.68,440.28 0 top  (outside the outline)
C170  5n6  [C0805K]  477.59,433.53 0 top  (outside the outline)
C171  10u  [C0805K]  486.6,433.54 0 top  (outside the outline)
C172  1u  [C0805K]  495.6,433.55 0 top  (outside the outline)
C173  1u  [C0805K]  504.61,433.53 0 top  (outside the outline)
C174  5n6  [C0805K]  513.62,433.55 0 top  (outside the outline)
C175  5n6  [C0805K]  522.64,433.53 0 top  (outside the outline)
C176  10u  [C0805K]  531.65,433.54 0 top  (outside the outline)
C177  1u  [C0805K]  540.65,433.55 0 top  (outside the outline)
C178  1u  [C0805K]  549.66,433.55 0 top  (outside the outline)
C179  5n6  [C0805K]  477.57,426.81 0 top  (outside the outline)
C180  5n6  [C0805K]  486.58,426.8 0 top  (outside the outline)
C181  10u  [C0805K]  495.6,426.81 0 top  (outside the outline)
C182  100n  [C0805K]  207.66,407.59 0 top  (outside the outline)
C183  100n  [C0805K]  14.71,-19.16 0 top  (outside the outline)
C184  100n  [C0805K]  15.12,-4.12 0 top  (outside the outline)
C185  100nF  [C0805K]  -53.35,460.81 0 top  (outside the outline)
C186  100nF  [C0805K]  -44.34,460.81 0 top  (outside the outline)
C187  100nF  [C0805K]  -35.33,460.81 0 top  (outside the outline)
C188  100nF  [C0805K]  -26.32,460.81 0 top  (outside the outline)
C189  100nF  [C0805K]  -117.73,460.81 0 top  (outside the outline)
C190  100n  [C0805K]  22.85,-19.16 0 top  (outside the outline)
C191  100n  [C0805K]  33.24,-3.8 0 top  (outside the outline)
D1  UPT  [UPT]  168.91,144.78 180 top
D2  UPT  [UPT]  168.91,137.16 180 top
D3  S1K  [DO214AC]  14.61,129.54 270 top
D4  SM6T  [SMB]  50.55,129.29 90 top
D5  BZX84-C12  [SOT23]  143.51,128.27 0 top
D6  S1K  [DO214AC]  76.2,124.46 90 top
D7  S1K  [DO214AC]  78.74,124.46 90 top
D8  S1K  [DO214AC]  81.28,124.46 90 top
D9  S1K  [DO214AC]  83.82,124.46 90 top
D10  S1K  [DO214AC]  86.36,124.46 90 top
D11  S1K  [DO214AC]  88.9,124.46 90 top
D12  S1K  [DO214AC]  91.44,124.46 90 top
D13  UPT  [UPT]  171.45,121.92 180 top
D14  SM6T  [SMB]  176.53,121.92 90 top
D15  SM6T  [SMB]  181.61,121.92 90 top
D16  SM6T  [SMB]  186.69,121.92 90 top
D17  SM6T  [SMB]  191.77,121.92 90 top
D18  BAS16  [SOT23]  29.21,115.57 180 top
D19  UPT  [UPT]  167.64,114.3 180 top
D21  SM6T  [SMB]  181.61,113.03 90 top
D22  BAS16  [SOT23]  137.16,112.78 0 top
D23  BAS16  [SOT23]  29.46,107.19 0 top
D24  SM6T  [SMB]  71.37,103.12 90 top
D25  BAS16  [SOT23]  116.84,99.06 180 top
D26  BAS16  [SOT23]  8.89,38.1 0 top
D27  BAS16  [SOT23]  26.67,33.02 0 top
D28  BAS16  [SOT23]  24.13,15.24 90 top
D29  BAS16  [SOT23]  8.89,5.08 0 top
D30  BAT54S  [SOT23]  525.08,452.57 0 top  (outside the outline)
D31  BAT54S  [SOT23]  534.85,452.57 0 top  (outside the outline)
D32  BAT54S  [SOT23]  544.63,452.57 0 top  (outside the outline)
D33  BAT54S  [SOT23]  554.4,452.56 0 top  (outside the outline)
F1  [T_FILTER]  165.1,143.51 90 top
F2  [T_FILTER]  165.1,134.62 90 top
F3  [T_FILTER]  167.64,121.92 270 top
F4  [T_FILTER]  171.45,114.3 90 top
FF1  SN74LUC2G74  [LVC2G74]  -169.28,424.64 0 top  (outside the outline)
FF2  SN74LUC2G74  [LVC2G74]  -160.81,424.64 0 top  (outside the outline)
G1  CR2032V  [CR2032V]  44.5,216.37 0 top  (outside the outline)
IC1  SFH617G  [DIL04B]  156.21,144.78 270 top
IC2  SFH617G  [DIL04B]  156.21,138.43 270 top
IC3  SFH617G  [DIL04B]  156.21,132.08 90 top
IC4  SFH617G  [DIL04B]  156.21,125.73 90 top
IC5  DC_DC_TRACO_1W_DUAL  [DC_DC_TRACO_1W_DUAL]  120.65,123.19 270 top
IC6  74HCT14D  [SO14]  133.19,207.39 0 top  (outside the outline)
IC7  SFH617G  [DIL04B]  156.21,119.38 90 top
IC8  ATMEGA8_TQFP  [TQFP-32]  98.42,114.94 270 top
IC9  SFH617G  [DIL04B]  156.21,113.03 270 top
IC10  OP747AR  [SO14']  12.7,104.14 0 top
IC11  74HCT14D  [SO14]  146.05,104.14 270 top
IC12  LM4120  [SOT23-5]  91.19,100.33 180 top
IC13  74HC02D  [SO14]  166.37,99.06 270 top
IC14  74HCT14D  [SO14]  106.68,97.79 0 top
IC15  MAX232A  [SO16]  189.23,97.79 270 top
IC16  MAX232A  [SO16]  -163.89,420.78 0 top  (outside the outline)
IC17  FT232BM  [LQFP32]  187.96,85.09 0 top
IC18  DC_DC_TRACO_8W  [DIL_TRACO_DCDC]  129.54,82.55 270 top
IC19  DC_DC_NMSC  [DIL_NMSC_DCDC]  158.75,77.47 0 top
IC20  74HCT253D  [SO16]  16.51,74.42 0 top
IC21  93LC66SN  [SO-08]  180.34,66.55 0 top
IC22  LTC1622  [SO8]  40.64,64.77 0 top
IC23  M41T81  [SO8]  -155.19,418.08 0 top  (outside the outline)
IC24  74HCT573D  [SO20W]  85.6,10.16 0 top
IC25  SDRAM64MB  [TSOP54]  -39.65,403.91 0 top  (outside the outline)
IC26  SDRAM64MB  [TSOP54]  -105.59,433.92 0 top  (outside the outline)
IC27  ATMEGA8_TQFP  [TQFP-32]  158.75,27.94 0 top
IC28  OP747R  [SO14']  15.75,21.84 0 top
IC29  LM339D  [SO14']  36.83,21.08 0 top
IC30  24AA64SN  [SO-08]  -147.24,418.43 0 top  (outside the outline)
IC31  TLC7701  [SO8]  69.98,408.03 0 top  (outside the outline)
IC32  ICS7152  [SO8]  220.47,424.3 0 top  (outside the outline)
IC33  74AC08D  [SO14]  227.3,453.95 0 top  (outside the outline)
IC34  ADM811  [ADM811]  250.59,426.04 0 top  (outside the outline)
IC35  LMC7211AI  [SOT23-5]  492.1,451.24 0 top  (outside the outline)
IC36  74HCT14D_NM  [SO14]  480.59,450.28 0 top  (outside the outline)
IC37  LMC7211AI  [SOT23-5]  500.31,451.24 0 top  (outside the outline)
IC40  LMC7211AI  [SOT23-5]  508.52,451.24 0 top  (outside the outline)
IC42  LMC7211AI  [SOT23-5]  516.75,451.23 0 top  (outside the outline)
J1  [JP2Q]  170.18,129.54 180 top
J3  [MA03-2]  82.55,116.71 90 top
J6  [JP4]  88.9,106.68 0 top
J7  [JP4]  189.23,31.75 90 top
J8  [MA03-2]  182.88,30.48 90 top
JTAG1  HEADER  [JTAG_HEADER]  212.57,457.45 0 top  (outside the outline)
K2  SNR03024  [SNR-V]  115.57,116.84 90 top
K4  SNR03024  [SNR-V]  160.02,90.17 0 top
K5  GN200A1H  [GN-A]  118.36,21.08 0 top
K6  GN200A1H  [GN-A]  123.7,8.13 0 top
L1  BLM31PG  [L-0603]  21.59,132.72 90 top
L2  BLM18PG  [L-0603]  15.16,-11.6 0 top  (outside the outline)
L3  BLM31PG  [L-0603]  96.52,125.09 0 top
L4  IND_BLM  [IND_BLM]  168.91,106.68 270 top
L6  IND_BLM  [IND_BLM]  173.99,105.41 270 top
L7  IND_BLM  [IND_BLM]  176.53,105.41 270 top
L8  IND_BLM  [IND_BLM]  179.07,105.41 270 top
L9  IND_BLM  [IND_BLM]  181.61,105.41 270 top
L10  BLM18PG  [L-0603]  177.8,80.52 180 top
L11  [L5650M]  59.69,76.2 180 top
L12  BLM18PG  [L-0603]  147.32,33.02 180 top
L13  BLM18PG  [L-0603]  71.55,251.26 0 top  (outside the outline)
L14  BLM18PG  [L-0603]  159.66,299.38 0 top  (outside the outline)
L15  BLM18PG  [L-0603]  82.63,251.24 0 top  (outside the outline)
L16  BLM18PG  [L-0603]  93.72,251.25 0 top  (outside the outline)
L17  BLM18PG  [L-0603]  104.8,251.26 0 top  (outside the outline)
L18  BLM18PG  [L-0603]  115.89,251.24 0 top  (outside the outline)
L19  BLM18PG  [L-0603]  126.97,251.25 0 top  (outside the outline)
L20  BLM18PG  [L-0603]  138.06,251.25 0 top  (outside the outline)
L21  BLM18PG  [L-0603]  52.3,258.45 0 top  (outside the outline)
L22  BLM18PG  [L-0603]  63.38,258.44 0 top  (outside the outline)
L23  BLM18PG  [L-0603]  70.06,312.25 0 top  (outside the outline)
L24  BLM18PG  [L-0603]  81.15,312.26 0 top  (outside the outline)
L25  BLM18PG  [L-0603]  92.23,312.24 0 top  (outside the outline)
L26  BLM18PG  [IND_BLM]  68.37,461.94 0 top  (outside the outline)
L27  BLM18PG  [IND_BLM]  77.05,461.94 0 top  (outside the outline)
L28  BLM18PG  [IND_BLM]  85.73,461.95 0 top  (outside the outline)
L29  BLM18PG  [IND_BLM]  244.66,401 0 top  (outside the outline)
L30  BLM18PG  [IND_BLM]  253.34,401.01 0 top  (outside the outline)
L31  BLM18PG  [IND_BLM]  262.02,401 0 top  (outside the outline)
L32  BLM18PG  [IND_BLM]  270.7,401.01 0 top  (outside the outline)
L33  BLM18PG  [IND_BLM]  180.61,394.38 0 top  (outside the outline)
L34  BLM18PG  [IND_BLM]  189.28,394.38 0 top  (outside the outline)
L35  BLM18PG  [IND_BLM]  342.68,397.92 0 top  (outside the outline)
L36  0u12H  [IND_BLM]  351.36,397.93 0 top  (outside the outline)
L37  0u12H  [IND_BLM]  360.04,397.93 0 top  (outside the outline)
LED1  [CHIPLED_1206]  107.82,111.63 270 top
LED2  [CHIPLED_1206]  175.26,38.1 180 top
P1  [L02P]  11.43,142.24 0 top
P2  [L04P]  25.4,142.24 0 top
P3  [MODU30]  66.82,211.92 0 top  (outside the outline)
P4  [90-2]  140.97,139.7 180 top
P5  [MODU16]  177.8,139.7 0 top
P6  [MODU44]  125.25,267.87 0 top  (outside the outline)
P8  [MODU16]  105.72,211.93 0 top  (outside the outline)
P9  [L04P]  -60.89,405.36 0 top  (outside the outline)
P10  [L04P]  410.57,453.7 0 top  (outside the outline)
P11  RJ_45  [RJ_45]  368.26,454.89 0 top  (outside the outline)
Q1  BSS123  [SOT23]  23.5,130.81 270 top
Q2  BSS123  [SOT23]  27.94,130.81 90 top
Q3  IRF7471  [SO8]  59.69,11.68 0 top
Q4  BC847  [SOT-23]  21.59,126.36 270 top
Q5  IRF7103  [SO8-2]  102.23,126.36 0 top
Q6  IRF7103  [SO8-2]  109.22,126.36 0 top
Q7  IRF7471  [SO8]  67.56,8.13 0 top
Q8  IRF7103  [SO8-2]  71.12,121.92 0 top
Q9  IRFR5305  [DPAK]  136.91,121.92 0 top
Q10  BSS123  [SOT23]  29.21,120.65 0 top
Q11  BSS123  [SOT23]  142.49,116.84 0 top
Q12  FDV304P  [SOT23]  82.89,300.43 0 top  (outside the outline)
Q13  BSS123  [SOT23]  137.16,107.95 0 top
Q14  BSS123  [SOT23]  29.21,101.6 0 top
Q15  IRF7422  [SO8]  60.96,67.31 0 top
Q16  BSS123  [SOT23]  -24.22,422.39 0 top  (outside the outline)
Q17  BC327  [SOT54A]  99.5,405.14 0 top  (outside the outline)
Q18  BSS123  [SOT23]  -24.22,422.39 0 top  (outside the outline)
Q19  IRF7422  [SO8]  81.11,408.02 0 top  (outside the outline)
Q29  BSS123  [SOT23]  151.38,38.1 0 top
Q30  BSS123  [SOT23]  154.94,38.1 0 top
Q31  BSS123  [SOT23]  160.02,38.1 0 top
R1  470R  [R0805W]  147.96,142.24 90 top
R2  470R  [R0805W]  147.96,137.16 90 top
R3  2K21  [R0805W]  147.96,132.08 270 top
R4  10k  [R0805W]  31.75,130.81 90 top
R5  10k  [R0805W]  74.47,258.45 0 top  (outside the outline)
R6  0R  [R0805W]  103.32,312.26 0 top  (outside the outline)
R7  0R  [R0805W]  85.14,258.44 0 top  (outside the outline)
R8  0R  [R0805W]  95.82,258.44 0 top  (outside the outline)
R9  0R  [R0805W]  11.43,130.18 90 top
R10  12k1  [R0805W]  63.3,455.32 0 top  (outside the outline)
R11  10k  [R0805W]  106.49,258.43 0 top  (outside the outline)
R12  10k  [R0805W]  -147.63,411.74 0 top  (outside the outline)
R13  100R  [R0805W]  113.99,312.26 0 top  (outside the outline)
R14  10K  [R0805W]  124.67,312.27 0 top  (outside the outline)
R15  10K  [R0805W]  135.34,312.26 0 top  (outside the outline)
R16  100R  [R0805W]  146.02,312.25 0 top  (outside the outline)
R17  10K  [R0805W]  156.69,312.25 0 top  (outside the outline)
R18  100R  [R0805W]  70.06,318.89 0 top  (outside the outline)
R19  4K75  [R0805W]  80.74,318.88 0 top  (outside the outline)
R20  100R  [R0805W]  91.41,318.89 0 top  (outside the outline)
R21  2K21  [R0805W]  175.26,129.54 270 top
R22  2K21  [R0805W]  165.1,128.27 270 top
R23  470R  [R0805W]  147.96,127 90 top
R24  10k  [R0805W]  25.4,126.36 90 top
R25  10k  [R0805W]  28.57,126.36 270 top
R26  10k  [R0805W]  31.75,126.36 270 top
R27  0R  [R0805W]  102.09,318.88 0 top  (outside the outline)
R28  10k  [R0805W]  142.49,123.19 0 top
R29  470R  [R0805W]  163.83,123.19 270 top
R30  100k  [R0805W]  -24.17,422.39 0 top  (outside the outline)
R31  1K  [R0805W]  12.7,121.92 270 top
R32  2K21  [R0805W]  147.96,121.92 90 top
R33  10k  [R0805W]  61.72,121.16 90 top
R34  10k  [R0805W]  107.95,119.51 180 top
R35  10k  [R0805W]  88.9,119.38 0 top
R36  470R  [R0805W]  163.83,118.11 270 top
R37  10k  [R0805W]  107.95,116.97 180 top
R38  100R  [R0805W]  8.89,116.84 90 top
R39  100R  [R0805W]  12.7,116.84 270 top
R40  1K  [R0805W]  16.51,116.84 270 top
R41  1K  [R0805W]  20.32,116.84 270 top
R42  10k  [R0805W]  88.9,116.84 0 top
R43  2K21  [R0805W]  147.96,116.84 270 top
R44  3K32  [R0805W]  112.76,318.88 0 top  (outside the outline)
R45  1K  [R0805W]  123.44,318.88 0 top  (outside the outline)
R46  100R  [R0805W]  -24.17,422.39 0 top  (outside the outline)
R47  10k  [R0805W]  77.47,115.57 90 top
R48  1k  [R0805W]  107.95,114.17 0 top
R49  10K  [R0805W]  134.11,318.9 0 top  (outside the outline)
R50  10k  [R0805W]  117.17,258.45 0 top  (outside the outline)
R51  10k  [R0805W]  132.08,113.03 180 top
R52  2k2  [R0805W]  142.49,113.03 180 top
R53  2K21  [R0805W]  163.83,113.03 90 top
R54  100R  [R0805W]  8.89,111.76 90 top
R55  1K  [R0805W]  12.7,111.76 90 top
R56  220K  [R0805W]  16.51,111.76 270 top
R57  220K  [R0805W]  20.32,111.76 270 top
R58  10k  [R0805W]  162.56,106.68 90 top
R59  470R  [R0805W]  166.37,106.68 270 top
R60  10K  [R0805W]  144.79,318.89 0 top  (outside the outline)
R61  4K75  [R0805W]  155.46,318.88 0 top  (outside the outline)
R62  4K75  [R0805W]  70.06,325.53 0 top  (outside the outline)
R63  4K75  [R0805W]  80.74,325.53 0 top  (outside the outline)
R64  4K75  [R0805W]  91.41,325.52 0 top  (outside the outline)
R65  10k  [R0805W]  173.99,100.33 180 top
R66  100R  [R0805W]  7.62,96.52 270 top
R67  220K  [R0805W]  11.43,96.52 270 top
R68  1K  [R0805W]  15.24,96.52 90 top
R69  1K  [R0805W]  19.05,96.52 270 top
R70  220K  [R0805W]  22.86,96.52 90 top
R71  100R  [R0805W]  26.67,96.52 90 top
R72  100R  [R0805W]  30.48,96.52 270 top
R73  1K  [R0805W]  7.62,91.44 270 top
R74  1K  [R0805W]  11.43,91.44 90 top
R75  220K  [R0805W]  15.24,91.44 90 top
R76  220K  [R0805W]  19.05,91.44 90 top
R77  1K  [R0805W]  22.86,91.44 90 top
R78  100R  [R0805W]  26.67,91.44 90 top
R79  137R  [R0805W]  30.48,91.44 90 top
R80  10k  [R0805W]  -167.65,423.32 0 top  (outside the outline)
R81  1K  [R0805W]  7.62,86.36 90 top
R82  137R  [R0805W]  11.43,86.36 90 top
R83  100R  [R0805W]  15.24,86.36 90 top
R84  1K  [R0805W]  22.86,86.36 270 top
R85  1K  [R0805W]  26.67,86.36 90 top
R86  1k  [R0805W]  -156.97,423.32 0 top  (outside the outline)
R87  1k  [R0805W]  -146.3,423.32 0 top  (outside the outline)
R88  100R  [R0805W]  7.62,81.28 90 top
R89  10k  [R0805W]  -167.65,423.32 0 top  (outside the outline)
R90  10k  [R0805W]  185.42,77.47 0 top
R91  470R  [R0805W]  179.07,74.93 180 top
R92  1k5  [R0805W]  185.42,74.68 0 top
R93  27R  [R0805W]  190.5,73.66 180 top
R94  27R  [R0805W]  190.5,71.12 180 top
R95  4k7  [R0805W]  190.5,68.58 0 top
R96  10k  [R0805W]  190.5,66.04 0 top
R97  2k21  [R0805W]  185.42,63.5 270 top
R98  0R_NM  [R0805W]  -156.98,423.32 0 top  (outside the outline)
R99  2k4  [R0805W]  -146.3,423.32 0 top  (outside the outline)
R100  2k4  [R0805W]  -167.65,423.32 0 top  (outside the outline)
R101  2k4  [R0805W]  -156.98,423.32 0 top  (outside the outline)
R102  2k2  [R0805W]  44.45,58.42 270 top
R103  2k2  [R0805W]  54.61,58.42 90 top
R104  2k2  [R0805W]  57.15,58.42 90 top
R105  0R025  [R2010W]  63.5,58.42 270 top
R106  2k4  [R0805W]  -146.3,423.32 0 top  (outside the outline)
R107  2k4  [R0805W]  -167.65,423.32 0 top  (outside the outline)
R108  2k4  [R0805W]  -156.98,423.32 0 top  (outside the outline)
R109  0R_NM  [R0805W]  -146.3,423.32 0 top  (outside the outline)
R110  0R_NM  [R0805W]  -167.65,423.32 0 top  (outside the outline)
R111  15k  [R0805W]  -22.32,445.64 0 top  (outside the outline)
R112  0R_NM  [R0805W]  -156.98,423.32 0 top  (outside the outline)
R113  2k4  [R0805W]  73.98,455.3 0 top  (outside the outline)
R114  2K21  [R0805W]  172.72,38.1 90 top
R115  3k32  [R0805W]  34.29,35.56 180 top
R116  6k81  [R0805W]  39.37,35.56 180 top
R117  560k  [R0805W]  8.89,33.02 90 top
R118  150k  [R0805W]  11.43,33.02 90 top
R119  150k  [R0805W]  19.05,33.02 90 top
R120  560k  [R0805W]  22.86,33.02 270 top
R121  0R_NM  [R0805W]  34.29,33.02 180 top
R122  3k92  [R0805W]  39.37,33.02 180 top
R123  0R_NM  [R0805W]  34.29,30.48 180 top
R124  3k92  [R0805W]  39.37,30.48 180 top
R125  10R  [R0805W]  13.97,29.21 270 top
R126  3k32  [R0805W]  16.51,29.21 270 top
R127  3k32  [R0805W]  34.29,27.94 180 top
R128  6k81  [R0805W]  39.37,27.94 180 top
R129  2k21  [R0805W]  170.18,27.94 0 top
R130  2k21  [R0805W]  -146.3,423.32 0 top  (outside the outline)
R131  2k21  [R0805W]  -167.65,423.32 0 top  (outside the outline)
R132  10R  [R0805W]  13.97,13.97 90 top
R133  3k32  [R0805W]  16.51,13.97 90 top
R134  3k32  [R0805W]  34.29,13.97 0 top
R135  3k92  [R0805W]  39.37,13.97 180 top
R136  560k  [R0805W]  22.86,11.43 90 top
R137  0R_NM  [R0805W]  34.29,11.43 180 top
R138  6k81  [R0805W]  39.37,11.43 180 top
R139  150k  [R0805W]  11.43,10.16 270 top
R140  150k  [R0805W]  19.05,10.16 270 top
R141  0R_NM  [R0805W]  34.29,8.89 180 top
R142  6k81  [R0805W]  39.37,8.89 180 top
R143  3k32  [R0805W]  34.29,6.35 180 top
R144  3k92  [R0805W]  39.37,6.35 0 top
R145  560k  [R0805W]  12.7,5.08 270 top
R146  61R9  [R0805W]  84.65,455.31 0 top  (outside the outline)
R147  0R_NM  [R0805W]  95.33,455.31 0 top  (outside the outline)
R148  27k  [R0805W]  106,455.32 0 top  (outside the outline)
R149  2k4  [R0805W]  116.66,455.3 0 top  (outside the outline)
R150  2k4  [R0805W]  36.25,462.04 0 top  (outside the outline)
R151  2k4  [R0805W]  46.93,462.05 0 top  (outside the outline)
R152  47R  [R0805W]  57.6,462.04 0 top  (outside the outline)
R153  1k  [R0805W]  -24.17,422.39 0 top  (outside the outline)
R154  1k  [R0805W]  -24.17,422.39 0 top  (outside the outline)
R155  10k  [R0805W]  -24.17,422.39 0 top  (outside the outline)
R156  1k  [R0805W]  -24.17,422.39 0 top  (outside the outline)
R157  1k  [R0805W]  -24.17,422.39 0 top  (outside the outline)
R158  10k  [R0805W]  -24.17,422.39 0 top  (outside the outline)
R159  2k4  [R0805W]  216.58,407.62 0 top  (outside the outline)
R160  0R  [R0805W]  227.25,407.63 0 top  (outside the outline)
R161  47R  [R0805W]  -117.84,455.28 0 top  (outside the outline)
R162  47R  [R0805W]  -107.16,455.29 0 top  (outside the outline)
R163  2k4  [R0805W]  -96.49,455.29 0 top  (outside the outline)
R164  2k4  [R0805W]  -85.81,455.28 0 top  (outside the outline)
R165  2k4  [R0805W]  -75.14,455.29 0 top  (outside the outline)
R166  2k4  [R0805W]  -64.46,455.29 0 top  (outside the outline)
R167  2k4  [R0805W]  -53.79,455.28 0 top  (outside the outline)
R168  2k4  [R0805W]  -43.11,455.29 0 top  (outside the outline)
R169  2k4  [R0805W]  -32.44,455.3 0 top  (outside the outline)
R170  2k4  [R0805W]  -21.76,455.28 0 top  (outside the outline)
R171  2k4  [R0805W]  -117.84,461.92 0 top  (outside the outline)
R172  2k4  [R0805W]  -107.16,461.91 0 top  (outside the outline)
R173  2k4  [R0805W]  -96.49,461.92 0 top  (outside the outline)
R174  2k4  [R0805W]  -85.81,461.91 0 top  (outside the outline)
R175  2k4  [R0805W]  -75.14,461.91 0 top  (outside the outline)
R176  2k4  [R0805W]  -64.46,461.92 0 top  (outside the outline)
R177  2k4  [R0805W]  -53.79,461.91 0 top  (outside the outline)
R178  2k4  [R0805W]  -43.11,461.91 0 top  (outside the outline)
R179  15k  [R0805W]  -32.44,461.91 0 top  (outside the outline)
R180  15k  [R0805W]  -21.76,461.92 0 top  (outside the outline)
R181  15k  [R0805W]  237.93,407.64 0 top  (outside the outline)
R182  15k  [R0805W]  248.6,407.62 0 top  (outside the outline)
R183  15k  [R0805W]  259.28,407.62 0 top  (outside the outline)
R184  15k  [R0805W]  180.54,400.9 0 top  (outside the outline)
R185  1.5M  [R0805W]  191.21,400.89 0 top  (outside the outline)
R186  82R  [R0805W]  201.89,400.9 0 top  (outside the outline)
R187  2k4  [R0805W]  212.55,400.89 0 top  (outside the outline)
R188  15k  [R0805W]  223.23,400.9 0 top  (outside the outline)
R189  2k4  [R0805W]  233.9,400.9 0 top  (outside the outline)
R190  47R  [R0805W]  340.94,411.17 0 top  (outside the outline)
R191  47R  [R0805W]  351.62,411.18 0 top  (outside the outline)
R192  2k  [R0805W]  362.29,411.19 0 top  (outside the outline)
R193  1k54  [R0805W]  372.97,411.17 0 top  (outside the outline)
R194  0R  [R0805W]  383.64,411.18 0 top  (outside the outline)
R195  12k1  [R0805W]  394.32,411.19 0 top  (outside the outline)
R196  12k1  [R0805W]  404.99,411.17 0 top  (outside the outline)
R197  15k  [R0805W]  415.67,411.19 0 top  (outside the outline)
R198  15k  [R0805W]  331.93,404.44 0 top  (outside the outline)
R199  15k  [R0805W]  342.61,404.45 0 top  (outside the outline)
R200  15k  [R0805W]  353.28,404.46 0 top  (outside the outline)
R201  15k  [R0805W]  363.96,404.44 0 top  (outside the outline)
R202  330R  [R0805W]  374.63,404.45 0 top  (outside the outline)
R203  61R9  [R0805W]  385.31,404.44 0 top  (outside the outline)
R204  61R9  [R0805W]  395.98,404.45 0 top  (outside the outline)
R205  61R9  [R0805W]  406.66,404.44 0 top  (outside the outline)
R206  61R9  [R0805W]  417.33,404.45 0 top  (outside the outline)
R207  330R  [R0805W]  331.93,397.83 0 top  (outside the outline)
R214  1k  [R0805W]  504.52,426.86 0 top  (outside the outline)
R215  20k  [R0805W]  515.19,426.87 0 top  (outside the outline)
R216  1k  [R0805W]  525.87,426.86 0 top  (outside the outline)
R217  100k  [R0805W]  536.54,426.86 0 top  (outside the outline)
R218  100R  [R0805W]  547.22,426.87 0 top  (outside the outline)
R219  1M  [R0805W]  477.49,420.12 0 top  (outside the outline)
R220  1k  [R0805W]  488.16,420.13 0 top  (outside the outline)
R221  20k  [R0805W]  498.84,420.14 0 top  (outside the outline)
R222  1k  [R0805W]  509.51,420.13 0 top  (outside the outline)
R223  100k  [R0805W]  520.19,420.13 0 top  (outside the outline)
R224  100R  [R0805W]  530.86,420.14 0 top  (outside the outline)
R225  1M  [R0805W]  541.54,420.12 0 top  (outside the outline)
R226  1k  [R0805W]  552.2,420.12 0 top  (outside the outline)
R227  20k  [R0805W]  477.48,413.5 0 top  (outside the outline)
R228  1k  [R0805W]  488.15,413.5 0 top  (outside the outline)
R229  100k  [R0805W]  498.83,413.5 0 top  (outside the outline)
R230  100R  [R0805W]  509.5,413.5 0 top  (outside the outline)
R231  1M  [R0805W]  520.18,413.49 0 top  (outside the outline)
R232  1k  [R0805W]  530.85,413.49 0 top  (outside the outline)
R233  20k  [R0805W]  541.52,413.5 0 top  (outside the outline)
R234  1k  [R0805W]  552.2,413.49 0 top  (outside the outline)
R235  100k  [R0805W]  477.47,406.86 0 top  (outside the outline)
R236  100R  [R0805W]  488.15,406.87 0 top  (outside the outline)
R237  1M  [R0805W]  498.82,406.86 0 top  (outside the outline)
R238  10k  [R0805W]  23.25,-3.81 0 top  (outside the outline)
R239  10K  [R0805W]  3.81,-19.53 0 top  (outside the outline)
R240  1k  [R0805W]  32.97,-19.4 0 top  (outside the outline)
R241  1k  [R0805W]  33.06,-12.42 0 top  (outside the outline)
U1  NS9360  [NS9360]  -34.81,275.23 0 top  (outside the outline)
U$10  TESTPAD  [TESTPAD]  -204.12,29.36 0 top  (outside the outline)
U$13  TESTPAD  [TESTPAD]  -204.12,141.12 0 top  (outside the outline)
U$21  TESTPAD  [TESTPAD]  -204.12,127.15 0 top  (outside the outline)
U$22  TESTPAD  [TESTPAD]  -204.12,113.18 0 top  (outside the outline)
U$23  TESTPAD  [TESTPAD]  -204.12,99.21 0 top  (outside the outline)
U$25  TESTPAD  [TESTPAD]  -204.12,71.27 0 top  (outside the outline)
U$30  TESTPAD  [TESTPAD]  -204.12,57.3 0 top  (outside the outline)
U$31  TESTPAD  [TESTPAD]  -204.12,210.97 0 top  (outside the outline)
U$37  TESTPAD  [TESTPAD]  -204.12,197 0 top  (outside the outline)
U$40  TESTPAD  [TESTPAD]  -204.12,183.03 0 top  (outside the outline)
U$49  TESTPAD  [TESTPAD]  -204.12,343.23 0 top  (outside the outline)
U$50  TESTPAD  [TESTPAD]  -204.12,329.26 0 top  (outside the outline)
U$51  TESTPAD  [TESTPAD]  -204.12,315.29 0 top  (outside the outline)
U$52  TESTPAD  [TESTPAD]  -204.12,301.32 0 top  (outside the outline)
U$54  TESTPAD  [TESTPAD]  -204.12,287.35 0 top  (outside the outline)
U$55  TESTPAD  [TESTPAD]  -204.12,231.47 0 top  (outside the outline)
U$57  TESTPAD  [TESTPAD]  -204.12,245.44 0 top  (outside the outline)
U$60  TESTPAD  [TESTPAD]  -204.12,15.39 0 top  (outside the outline)
U$64  TESTPAD  [TESTPAD]  -204.12,1.42 0 top  (outside the outline)
U$65  TESTPAD  [TESTPAD]  -204.12,-3.66 0 top  (outside the outline)
U$68  TESTPAD  [TESTPAD]  -204.12,-3.66 0 top  (outside the outline)
U$69  TESTPAD  [TESTPAD]  -204.12,-3.66 0 top  (outside the outline)
U$73  TESTPAD  [TESTPAD]  -204.12,-3.66 0 top  (outside the outline)
U$74  TESTPAD  [TESTPAD]  -391.53,252.34 0 top  (outside the outline)
U$75  TESTPAD  [TESTPAD]  -204.12,-3.66 0 top  (outside the outline)
U$76  TESTPAD  [TESTPAD]  -204.12,-3.66 0 top  (outside the outline)
U$80  TESTPAD  [TESTPAD]  -204.12,-3.66 0 top  (outside the outline)
U$82  TESTPAD  [TESTPAD]  -204.12,169.06 0 top  (outside the outline)
U$83  TESTPAD  [TESTPAD]  -204.12,155.09 0 top  (outside the outline)
U$84  TESTPAD  [TESTPAD]  -204.12,85.24 0 top  (outside the outline)
U$92  TESTPAD  [TESTPAD]  -323.49,36.62 0 top  (outside the outline)
U$93  FLASH_M29DW640D  [TSOP48]  -77.77,409.77 0 top  (outside the outline)
U$99  TESTPAD  [TESTPAD]  -323.49,36.62 0 top  (outside the outline)
U$101  TESTPAD  [TESTPAD]  -391.53,0.88 0 top  (outside the outline)
U$113  LP3982  [MSOP8]  90.77,407.14 0 top  (outside the outline)
U$127  ICS1893BF  [ISC1893BF]  391.04,459.23 0 top  (outside the outline)
U$140  TESTPAD  [TESTPAD]  -391.53,336.15 0 top  (outside the outline)
U$141  TESTPAD  [TESTPAD]  -391.53,322.19 0 top  (outside the outline)
U$142  TESTPAD  [TESTPAD]  -391.53,308.21 0 top  (outside the outline)
U$143  TESTPAD  [TESTPAD]  -391.53,294.25 0 top  (outside the outline)
U$144  TESTPAD  [TESTPAD]  -390,350.3 0 top  (outside the outline)
U$145  TESTPAD  [TESTPAD]  -204.12,-3.66 0 top  (outside the outline)
U$146  TESTPAD  [TESTPAD]  -204.12,-3.66 0 top  (outside the outline)
U$147  TESTPAD  [TESTPAD]  -204.12,-3.66 0 top  (outside the outline)
U$148  TESTPAD  [TESTPAD]  -204.12,-3.66 0 top  (outside the outline)
U$149  TESTPAD  [TESTPAD]  -323.49,36.62 0 top  (outside the outline)
U$150  TESTPAD  [TESTPAD]  -204.12,-3.66 0 top  (outside the outline)
U$151  TESTPAD  [TESTPAD]  -204.12,-3.66 0 top  (outside the outline)
U$152  TESTPAD  [TESTPAD]  -204.12,-3.66 0 top  (outside the outline)
U$153  TESTPAD  [TESTPAD]  -204.12,-3.66 0 top  (outside the outline)
U$154  TESTPAD  [TESTPAD]  -204.12,-3.66 0 top  (outside the outline)
U$155  TESTPAD  [TESTPAD]  -204.12,-3.66 0 top  (outside the outline)
U$156  TESTPAD  [TESTPAD]  -204.12,-3.66 0 top  (outside the outline)
U$157  TESTPAD  [TESTPAD]  -204.12,-3.66 0 top  (outside the outline)
U$158  TESTPAD  [TESTPAD]  -204.12,-3.66 0 top  (outside the outline)
U$159  TESTPAD  [TESTPAD]  -204.12,-3.66 0 top  (outside the outline)
U$160  TESTPAD  [TESTPAD]  -204.12,-3.66 0 top  (outside the outline)
U$161  TESTPAD  [TESTPAD]  -204.12,-3.66 0 top  (outside the outline)
U$162  TESTPAD  [TESTPAD]  -323.49,36.62 0 top  (outside the outline)
U$163  TESTPAD  [TESTPAD]  -204.12,-3.66 0 top  (outside the outline)
U$164  TESTPAD  [TESTPAD]  -389.92,-68.39 0 top  (outside the outline)
U$165  TESTPAD  [TESTPAD]  -389.92,-26.48 0 top  (outside the outline)
U$166  TESTPAD  [TESTPAD]  -391.53,280.27 0 top  (outside the outline)
U$167  TESTPAD  [TESTPAD]  -204.12,-3.66 0 top  (outside the outline)
U$168  TESTPAD  [TESTPAD]  -391.53,236.24 0 top  (outside the outline)
U$169  TESTPAD  [TESTPAD]  -391.53,224.4 0 top  (outside the outline)
U$170  TESTPAD  [TESTPAD]  -391.53,210.43 0 top  (outside the outline)
U$171  TESTPAD  [TESTPAD]  -391.53,196.46 0 top  (outside the outline)
U$172  TESTPAD  [TESTPAD]  -204.12,-3.66 0 top  (outside the outline)
U$173  TESTPAD  [TESTPAD]  -204.12,-3.66 0 top  (outside the outline)
U$174  TESTPAD  [TESTPAD]  -204.12,-3.66 0 top  (outside the outline)
U$175  TESTPAD  [TESTPAD]  -204.12,-3.66 0 top  (outside the outline)
U$176  TESTPAD  [TESTPAD]  -204.12,-3.66 0 top  (outside the outline)
U$177  TESTPAD  [TESTPAD]  -204.12,-3.66 0 top  (outside the outline)
U$178  TESTPAD  [TESTPAD]  -204.12,-3.66 0 top  (outside the outline)
U$179  TESTPAD  [TESTPAD]  -204.12,-3.66 0 top  (outside the outline)
U$180  TESTPAD  [TESTPAD]  -204.12,-3.66 0 top  (outside the outline)
U$181  TESTPAD  [TESTPAD]  -204.12,-3.66 0 top  (outside the outline)
U$182  TESTPAD  [TESTPAD]  -204.12,-3.66 0 top  (outside the outline)
U$183  TESTPAD  [TESTPAD]  -204.12,-3.66 0 top  (outside the outline)
U$184  TESTPAD  [TESTPAD]  -204.12,-3.66 0 top  (outside the outline)
U$185  TESTPAD  [TESTPAD]  -204.12,-3.66 0 top  (outside the outline)
U$186  TESTPAD  [TESTPAD]  -204.12,-3.66 0 top  (outside the outline)
U$187  TESTPAD  [TESTPAD]  -204.12,-3.66 0 top  (outside the outline)
U$188  TESTPAD  [TESTPAD]  -204.12,-3.66 0 top  (outside the outline)
U$189  TESTPAD  [TESTPAD]  -204.12,-3.66 0 top  (outside the outline)
U$190  TESTPAD  [TESTPAD]  -204.12,-3.66 0 top  (outside the outline)
U$191  TESTPAD  [TESTPAD]  -204.12,-3.66 0 top  (outside the outline)
U$192  TESTPAD  [TESTPAD]  -204.12,-3.66 0 top  (outside the outline)
U$193  TESTPAD  [TESTPAD]  -204.12,-3.66 0 top  (outside the outline)
U$194  TESTPAD  [TESTPAD]  -204.12,-3.66 0 top  (outside the outline)
U$195  TESTPAD  [TESTPAD]  -204.12,-3.66 0 top  (outside the outline)
U$196  TESTPAD  [TESTPAD]  -204.12,-3.66 0 top  (outside the outline)
U$197  TESTPAD  [TESTPAD]  -204.12,-3.66 0 top  (outside the outline)
U$198  TESTPAD  [TESTPAD]  -204.12,-3.66 0 top  (outside the outline)
U$199  TESTPAD  [TESTPAD]  -204.12,-3.66 0 top  (outside the outline)
U$200  TESTPAD  [TESTPAD]  -204.12,-3.66 0 top  (outside the outline)
U$201  TESTPAD  [TESTPAD]  -204.12,-3.66 0 top  (outside the outline)
U$202  TESTPAD  [TESTPAD]  -389.92,-40.45 0 top  (outside the outline)
U$203  TESTPAD  [TESTPAD]  -204.12,-3.66 0 top  (outside the outline)
U$204  TESTPAD  [TESTPAD]  -204.12,-3.66 0 top  (outside the outline)
U$205  TESTPAD  [TESTPAD]  -204.12,-3.66 0 top  (outside the outline)
U$206  TESTPAD  [TESTPAD]  -204.12,-3.66 0 top  (outside the outline)
U$207  TESTPAD  [TESTPAD]  -204.12,-3.66 0 top  (outside the outline)
U$208  TESTPAD  [TESTPAD]  -389.92,-12.51 0 top  (outside the outline)
U$209  TESTPAD  [TESTPAD]  -204.12,-3.66 0 top  (outside the outline)
U$210  TESTPAD  [TESTPAD]  -204.12,-3.66 0 top  (outside the outline)
U$211  TESTPAD  [TESTPAD]  -204.12,-3.66 0 top  (outside the outline)
U$212  TESTPAD  [TESTPAD]  -204.12,-3.66 0 top  (outside the outline)
U$213  TESTPAD  [TESTPAD]  -204.12,-3.66 0 top  (outside the outline)
U$214  TESTPAD  [TESTPAD]  -388.72,-132.73 0 top  (outside the outline)
U$215  TESTPAD  [TESTPAD]  -204.12,-3.66 0 top  (outside the outline)
U$216  TESTPAD  [TESTPAD]  -204.12,-3.66 0 top  (outside the outline)
U$217  TESTPAD  [TESTPAD]  -204.12,-3.66 0 top  (outside the outline)
U$218  TESTPAD  [TESTPAD]  -388.72,-146.7 0 top  (outside the outline)
U$219  TESTPAD  [TESTPAD]  -204.12,-3.66 0 top  (outside the outline)
U$220  TESTPAD  [TESTPAD]  -204.12,-3.66 0 top  (outside the outline)
U$221  TESTPAD  [TESTPAD]  -204.12,-3.66 0 top  (outside the outline)
U$222  TESTPAD  [TESTPAD]  -204.12,-3.66 0 top  (outside the outline)
U$223  TESTPAD  [TESTPAD]  -204.12,-3.66 0 top  (outside the outline)
U$224  TESTPAD  [TESTPAD]  -204.12,-3.66 0 top  (outside the outline)
U$225  TESTPAD  [TESTPAD]  -204.12,-3.66 0 top  (outside the outline)
U$226  TESTPAD  [TESTPAD]  -204.12,-3.66 0 top  (outside the outline)
U$227  TESTPAD  [TESTPAD]  -204.12,-3.66 0 top  (outside the outline)
U$228  TESTPAD  [TESTPAD]  -204.12,-3.66 0 top  (outside the outline)
U$229  TESTPAD  [TESTPAD]  -204.12,-3.66 0 top  (outside the outline)
U$230  TESTPAD  [TESTPAD]  -204.12,399.11 0 top  (outside the outline)
U$231  TESTPAD  [TESTPAD]  -204.12,385.14 0 top  (outside the outline)
U$232  TESTPAD  [TESTPAD]  -204.12,371.17 0 top  (outside the outline)
U$233  TESTPAD  [TESTPAD]  -391.53,182.49 0 top  (outside the outline)
U$234  TESTPAD  [TESTPAD]  -204.12,-3.66 0 top  (outside the outline)
U$235  TESTPAD  [TESTPAD]  -264.55,11.78 0 top  (outside the outline)
U$236  TESTPAD  [TESTPAD]  -264.55,207.36 0 top  (outside the outline)
U$237  TESTPAD  [TESTPAD]  -263.99,387.68 0 top  (outside the outline)
U$238  TESTPAD  [TESTPAD]  -263.99,373.71 0 top  (outside the outline)
U$239  TESTPAD  [TESTPAD]  -263.99,401.65 0 top  (outside the outline)
U$240  TESTPAD  [TESTPAD]  -263.99,345.77 0 top  (outside the outline)
U$241  TESTPAD  [TESTPAD]  -389.92,-54.42 0 top  (outside the outline)
U$242  TESTPAD  [TESTPAD]  -264.55,151.48 0 top  (outside the outline)
U$243  TESTPAD  [TESTPAD]  -264.55,137.51 0 top  (outside the outline)
U$244  TESTPAD  [TESTPAD]  -323.49,36.62 0 top  (outside the outline)
U$245  TESTPAD  [TESTPAD]  -264.55,123.54 0 top  (outside the outline)
U$246  TESTPAD  [TESTPAD]  -263.99,331.8 0 top  (outside the outline)
U$247  TESTPAD  [TESTPAD]  -323.49,36.62 0 top  (outside the outline)
U$248  TESTPAD  [TESTPAD]  -263.99,317.83 0 top  (outside the outline)
U$249  TESTPAD  [TESTPAD]  -263.99,303.86 0 top  (outside the outline)
U$250  TESTPAD  [TESTPAD]  -263.99,289.89 0 top  (outside the outline)
U$251  TESTPAD  [TESTPAD]  -263.99,275.92 0 top  (outside the outline)
U$252  TESTPAD  [TESTPAD]  -264.55,249.27 0 top  (outside the outline)
U$253  TESTPAD  [TESTPAD]  -264.55,235.3 0 top  (outside the outline)
U$254  TESTPAD  [TESTPAD]  -264.55,-2.19 0 top  (outside the outline)
U$255  TESTPAD  [TESTPAD]  -264.55,-9.81 0 top  (outside the outline)
U$256  TESTPAD  [TESTPAD]  -264.55,53.69 0 top  (outside the outline)
U$257  TESTPAD  [TESTPAD]  -264.55,39.72 0 top  (outside the outline)
U$258  TESTPAD  [TESTPAD]  -323.49,36.62 0 top  (outside the outline)
U$259  TESTPAD  [TESTPAD]  -264.55,81.63 0 top  (outside the outline)
U$260  TESTPAD  [TESTPAD]  -264.55,67.66 0 top  (outside the outline)
U$261  TESTPAD  [TESTPAD]  -264.55,109.57 0 top  (outside the outline)
U$262  TESTPAD  [TESTPAD]  -264.55,95.6 0 top  (outside the outline)
U$263  TESTPAD  [TESTPAD]  -323.49,36.62 0 top  (outside the outline)